# EAGLE design oresat-backplane-1u (EAGLE 9.6.1)

## Sheet 1 of 9: Slot 1
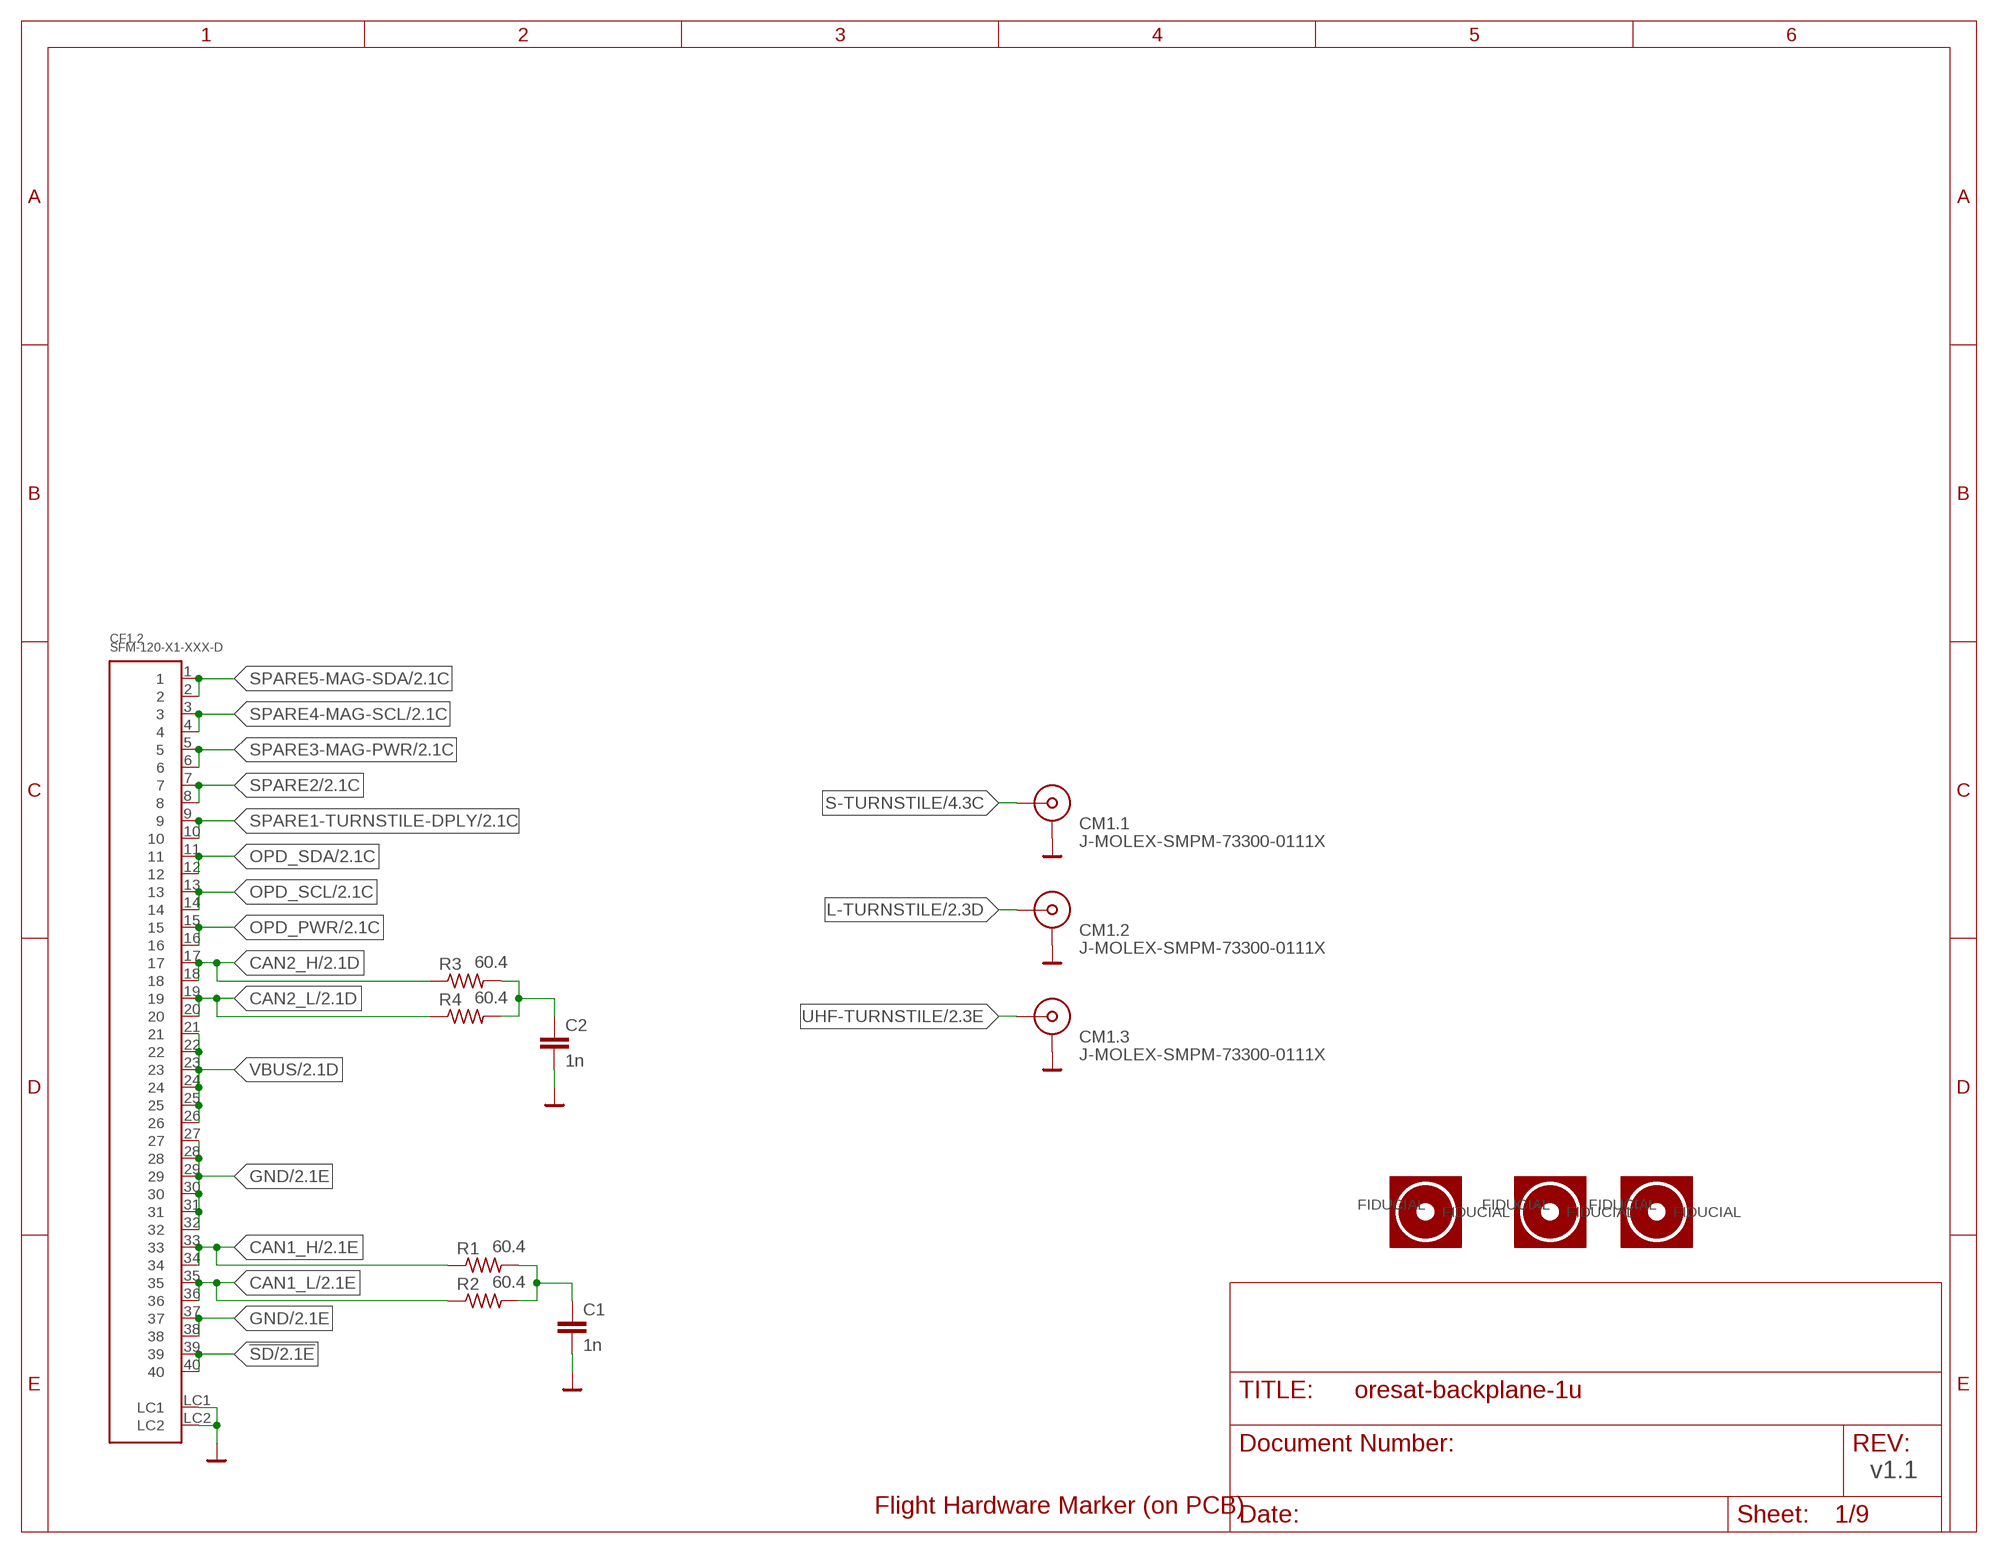
[diagram p0: schematic, sheet 1]

### Parts
C1  1n  C-EU0603-C-NOSILK  [.0603-C-NOSILK]
C2  1n  C-EU0603-C-NOSILK  [.0603-C-NOSILK]
CF1.2  SFM-120-X1-XXX-D  [SFM-120-X1-XXX-D]
CM1.1  J-MOLEX-SMPM-73300-0111X  [J-MOLEX-SMPM-73300-0111X]
CM1.2  J-MOLEX-SMPM-73300-0111X  [J-MOLEX-SMPM-73300-0111X]
CM1.3  J-MOLEX-SMPM-73300-0111X  [J-MOLEX-SMPM-73300-0111X]
FIDUCIAL1  FIDUCIAL-1.0X2.0  [FIDUCIAL-1.0X2.0]
FIDUCIAL2  FIDUCIAL-1.0X2.0  [FIDUCIAL-1.0X2.0]
FIDUCIAL3  FIDUCIAL-1.0X2.0  [FIDUCIAL-1.0X2.0]
R1  60.4  R-US_1206-C  [1206-C]
R2  60.4  R-US_1206-C  [1206-C]
R3  60.4  R-US_1206-C  [1206-C]
R4  60.4  R-US_1206-C  [1206-C]
U$1  FLIGHMARKERNEW  [FLIGHTMARKER_NEW_BOARDS]

### Nets
!SD [SHUTDOWN]: CF1.2.39 CF1.2.40 ; also sheet 2,3,4,5,6,7,8
CAN1_H: CF1.2.33 CF1.2.34 R1.1 ; also sheet 2,3,4,5,6,7,8
CAN1_L: CF1.2.35 CF1.2.36 R2.1 ; also sheet 2,3,4,5,6,7,8
CAN2_H: CF1.2.17 CF1.2.18 R3.1 ; also sheet 2,3,4,5,6,7,8
CAN2_L: CF1.2.19 CF1.2.20 R4.1 ; also sheet 2,3,4,5,6,7,8
GND: C1.2 C2.2 CF1.2.27 CF1.2.28 CF1.2.29 CF1.2.30 CF1.2.31 CF1.2.32 CF1.2.37 CF1.2.38 CF1.2.LC1 CF1.2.LC2 CM1.1.P$1(SHIELD1) CM1.1.P$2(SHIELD1) CM1.1.P$3(SHIELD1) CM1.1.P$4(SHIELD1) CM1.2.P$1(SHIELD1) CM1.2.P$2(SHIELD1) CM1.2.P$3(SHIELD1) CM1.2.P$4(SHIELD1) CM1.3.P$1(SHIELD1) CM1.3.P$2(SHIELD1) CM1.3.P$3(SHIELD1) CM1.3.P$4(SHIELD1) ; also sheet 2,3,4,5,6,7,8,9
L-TURNSTILE [RF]: CM1.2.RF-DOWN(RF) ; also sheet 2
N$1: C2.1 R3.2 R4.2
N$2: C1.1 R1.2 R2.2
OPD_PWR: CF1.2.15 CF1.2.16 ; also sheet 2,3,4,5,6,7,8
OPD_SCL: CF1.2.13 CF1.2.14 ; also sheet 2,3,4,5,6,7,8
OPD_SDA: CF1.2.11 CF1.2.12 ; also sheet 2,3,4,5,6,7,8
S-TURNSTILE [RF]: CM1.1.RF-DOWN(RF) ; also sheet 4
SPARE1-TURNSTILE-DPLY: CF1.2.9 CF1.2.10 ; also sheet 2,3,4,5,6,7,8
SPARE2: CF1.2.7 CF1.2.8 ; also sheet 2,3,4,5,6,7,8,9
SPARE3-MAG-PWR: CF1.2.5 CF1.2.6 ; also sheet 2,3,4,5,6,7,8,9
SPARE4-MAG-SCL: CF1.2.3 CF1.2.4 ; also sheet 2,3,4,5,6,7,8,9
SPARE5-MAG-SDA: CF1.2.1 CF1.2.2 ; also sheet 2,3,4,5,6,7,8,9
UHF-TURNSTILE [RF]: CM1.3.RF-DOWN(RF) ; also sheet 2
VBUS: CF1.2.21 CF1.2.22 CF1.2.23 CF1.2.24 CF1.2.25 CF1.2.26 ; also sheet 2,3,4,5,6,7,8
Unconnected: FIDUCIAL1.FIDUCIAL FIDUCIAL2.FIDUCIAL FIDUCIAL3.FIDUCIAL

### Notes on the sheet
- v1.1

## Sheet 2 of 9: Slot 2
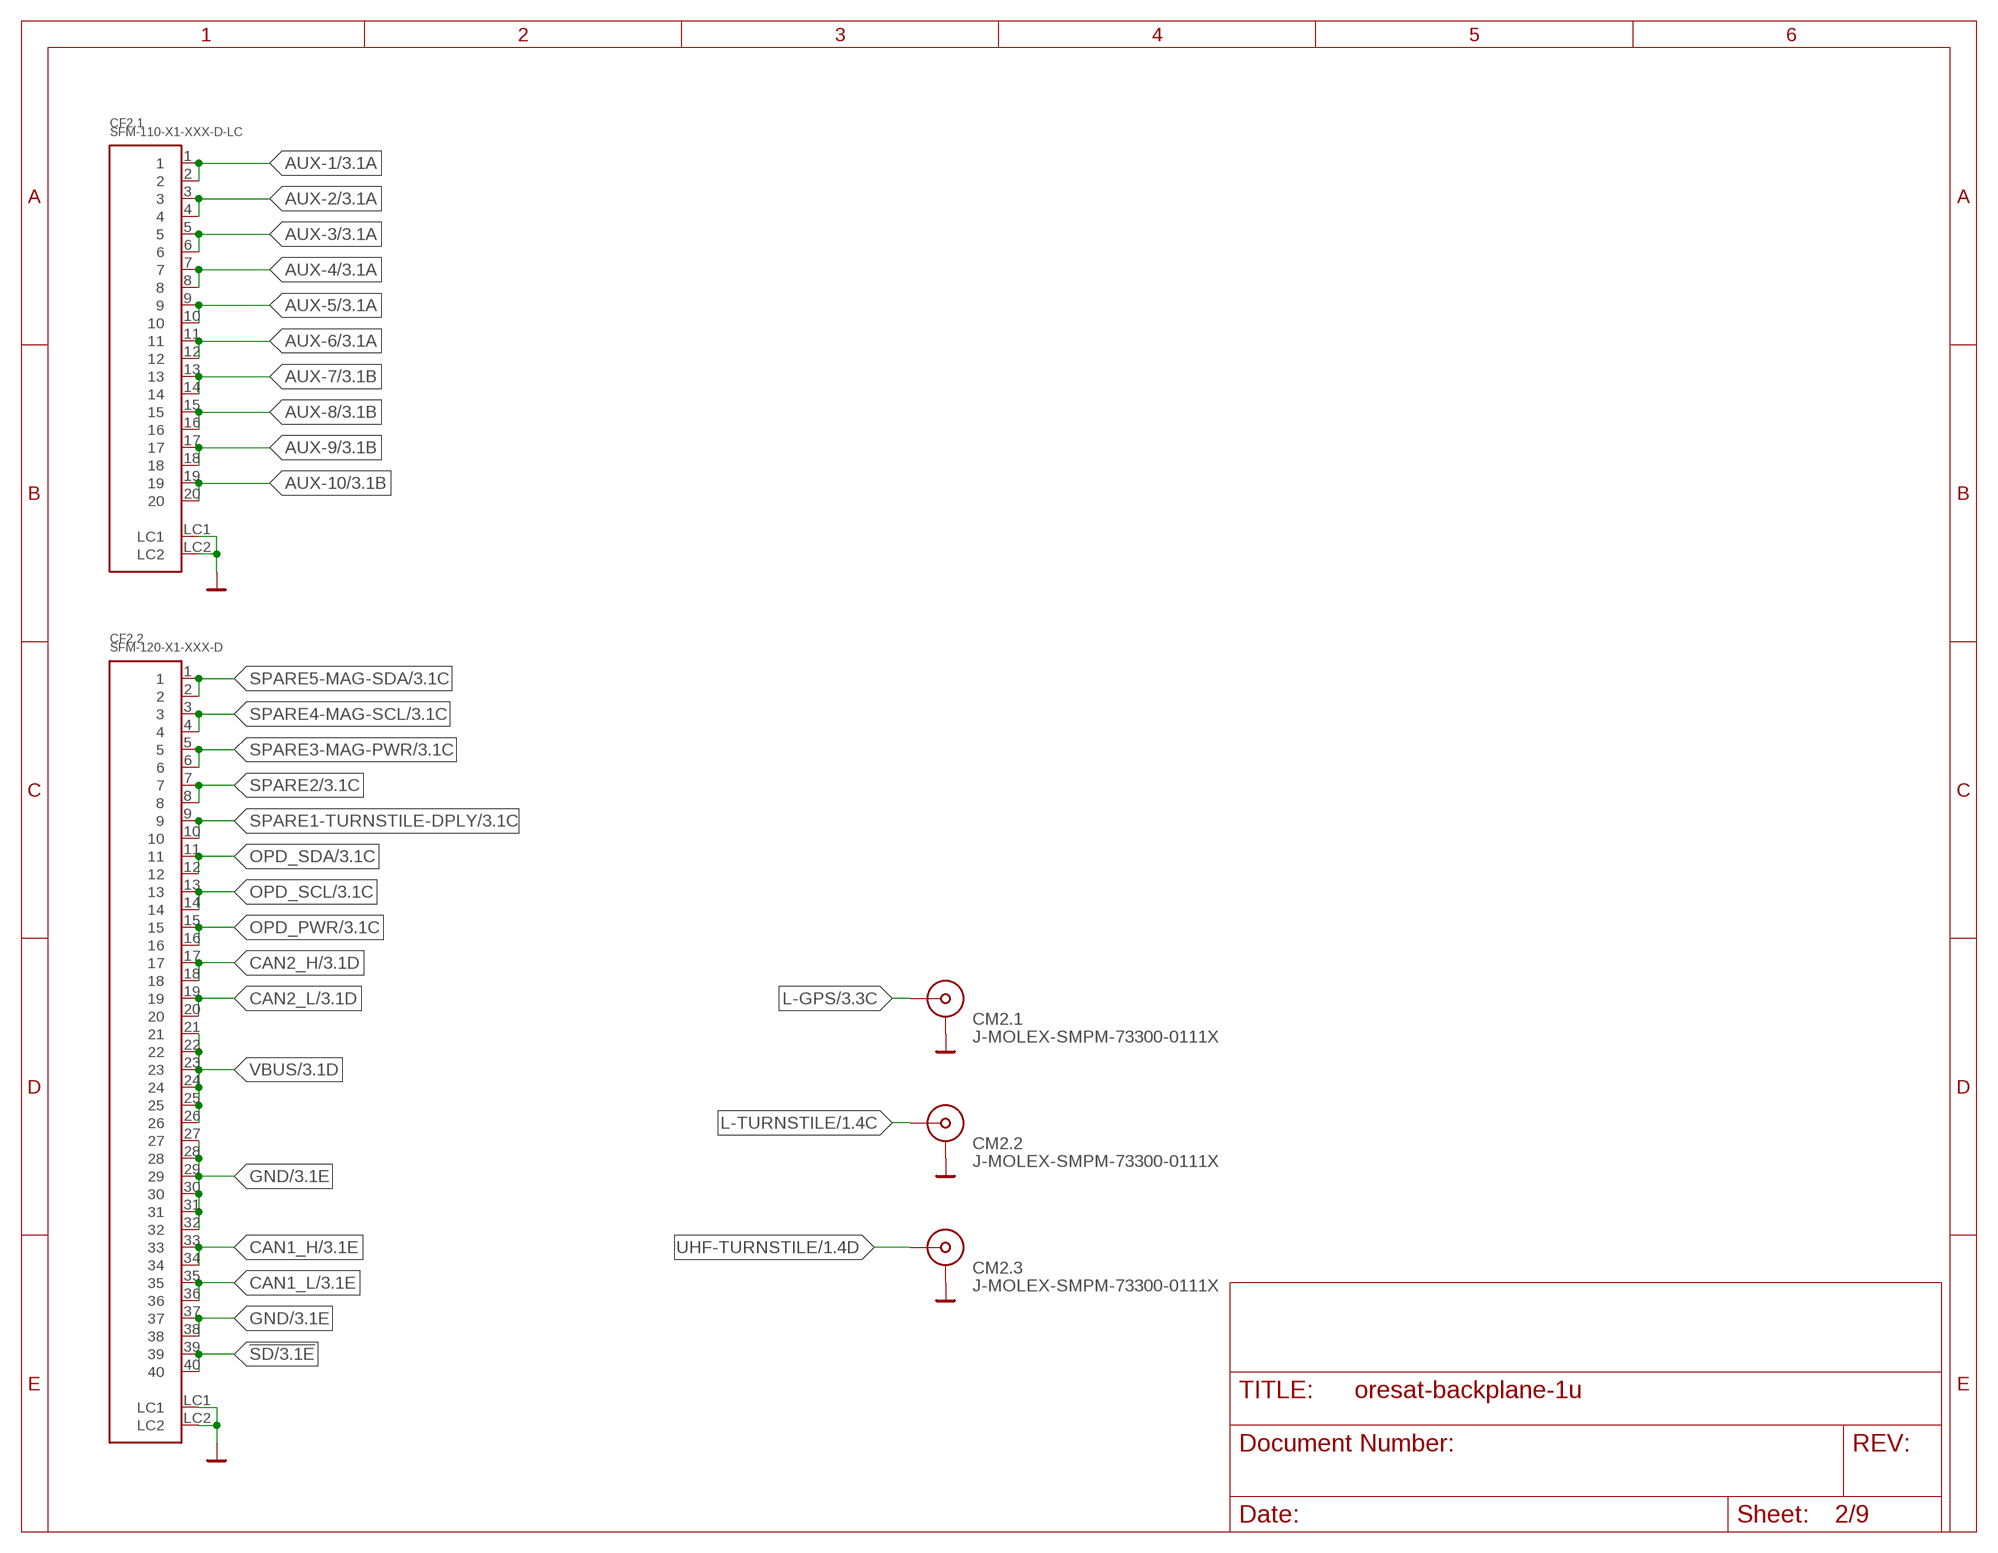
[diagram p1: schematic, sheet 2]

### Parts
CF2.1  SFM-110-X1-XXX-D-LC  [SFM-110-X1-XXX-D-LC]
CF2.2  SFM-120-X1-XXX-D  [SFM-120-X1-XXX-D]
CM2.1  J-MOLEX-SMPM-73300-0111X  [J-MOLEX-SMPM-73300-0111X]
CM2.2  J-MOLEX-SMPM-73300-0111X  [J-MOLEX-SMPM-73300-0111X]
CM2.3  J-MOLEX-SMPM-73300-0111X  [J-MOLEX-SMPM-73300-0111X]

### Nets
!SD [SHUTDOWN]: CF2.2.39 CF2.2.40 ; also sheet 1,3,4,5,6,7,8
AUX-1: CF2.1.1 CF2.1.2 ; also sheet 3,4,7,8
AUX-2: CF2.1.3 CF2.1.4 ; also sheet 3,4,7,8
AUX-3: CF2.1.5 CF2.1.6 ; also sheet 3,4,7,8
AUX-4: CF2.1.7 CF2.1.8 ; also sheet 3,4,7,8
AUX-5: CF2.1.9 CF2.1.10 ; also sheet 3,4,7,8
AUX-6: CF2.1.11 CF2.1.12 ; also sheet 3,4,7,8
AUX-7: CF2.1.13 CF2.1.14 ; also sheet 3,4,7,8
AUX-8: CF2.1.15 CF2.1.16 ; also sheet 3,4,7,8
AUX-9: CF2.1.17 CF2.1.18 ; also sheet 3,4,7,8
AUX-10: CF2.1.19 CF2.1.20 ; also sheet 3,4,7,8
CAN1_H: CF2.2.33 CF2.2.34 ; also sheet 1,3,4,5,6,7,8
CAN1_L: CF2.2.35 CF2.2.36 ; also sheet 1,3,4,5,6,7,8
CAN2_H: CF2.2.17 CF2.2.18 ; also sheet 1,3,4,5,6,7,8
CAN2_L: CF2.2.19 CF2.2.20 ; also sheet 1,3,4,5,6,7,8
GND: CF2.1.LC1 CF2.1.LC2 CF2.2.27 CF2.2.28 CF2.2.29 CF2.2.30 CF2.2.31 CF2.2.32 CF2.2.37 CF2.2.38 CF2.2.LC1 CF2.2.LC2 CM2.1.P$1(SHIELD1) CM2.1.P$2(SHIELD1) CM2.1.P$3(SHIELD1) CM2.1.P$4(SHIELD1) CM2.2.P$1(SHIELD1) CM2.2.P$2(SHIELD1) CM2.2.P$3(SHIELD1) CM2.2.P$4(SHIELD1) CM2.3.P$1(SHIELD1) CM2.3.P$2(SHIELD1) CM2.3.P$3(SHIELD1) CM2.3.P$4(SHIELD1) ; also sheet 1,3,4,5,6,7,8,9
L-GPS [RF]: CM2.1.RF-DOWN(RF) ; also sheet 3
L-TURNSTILE [RF]: CM2.2.RF-DOWN(RF) ; also sheet 1
OPD_PWR: CF2.2.15 CF2.2.16 ; also sheet 1,3,4,5,6,7,8
OPD_SCL: CF2.2.13 CF2.2.14 ; also sheet 1,3,4,5,6,7,8
OPD_SDA: CF2.2.11 CF2.2.12 ; also sheet 1,3,4,5,6,7,8
SPARE1-TURNSTILE-DPLY: CF2.2.9 CF2.2.10 ; also sheet 1,3,4,5,6,7,8
SPARE2: CF2.2.7 CF2.2.8 ; also sheet 1,3,4,5,6,7,8,9
SPARE3-MAG-PWR: CF2.2.5 CF2.2.6 ; also sheet 1,3,4,5,6,7,8,9
SPARE4-MAG-SCL: CF2.2.3 CF2.2.4 ; also sheet 1,3,4,5,6,7,8,9
SPARE5-MAG-SDA: CF2.2.1 CF2.2.2 ; also sheet 1,3,4,5,6,7,8,9
UHF-TURNSTILE [RF]: CM2.3.RF-DOWN(RF) ; also sheet 1
VBUS: CF2.2.21 CF2.2.22 CF2.2.23 CF2.2.24 CF2.2.25 CF2.2.26 ; also sheet 1,3,4,5,6,7,8

## Sheet 3 of 9: Slot 3
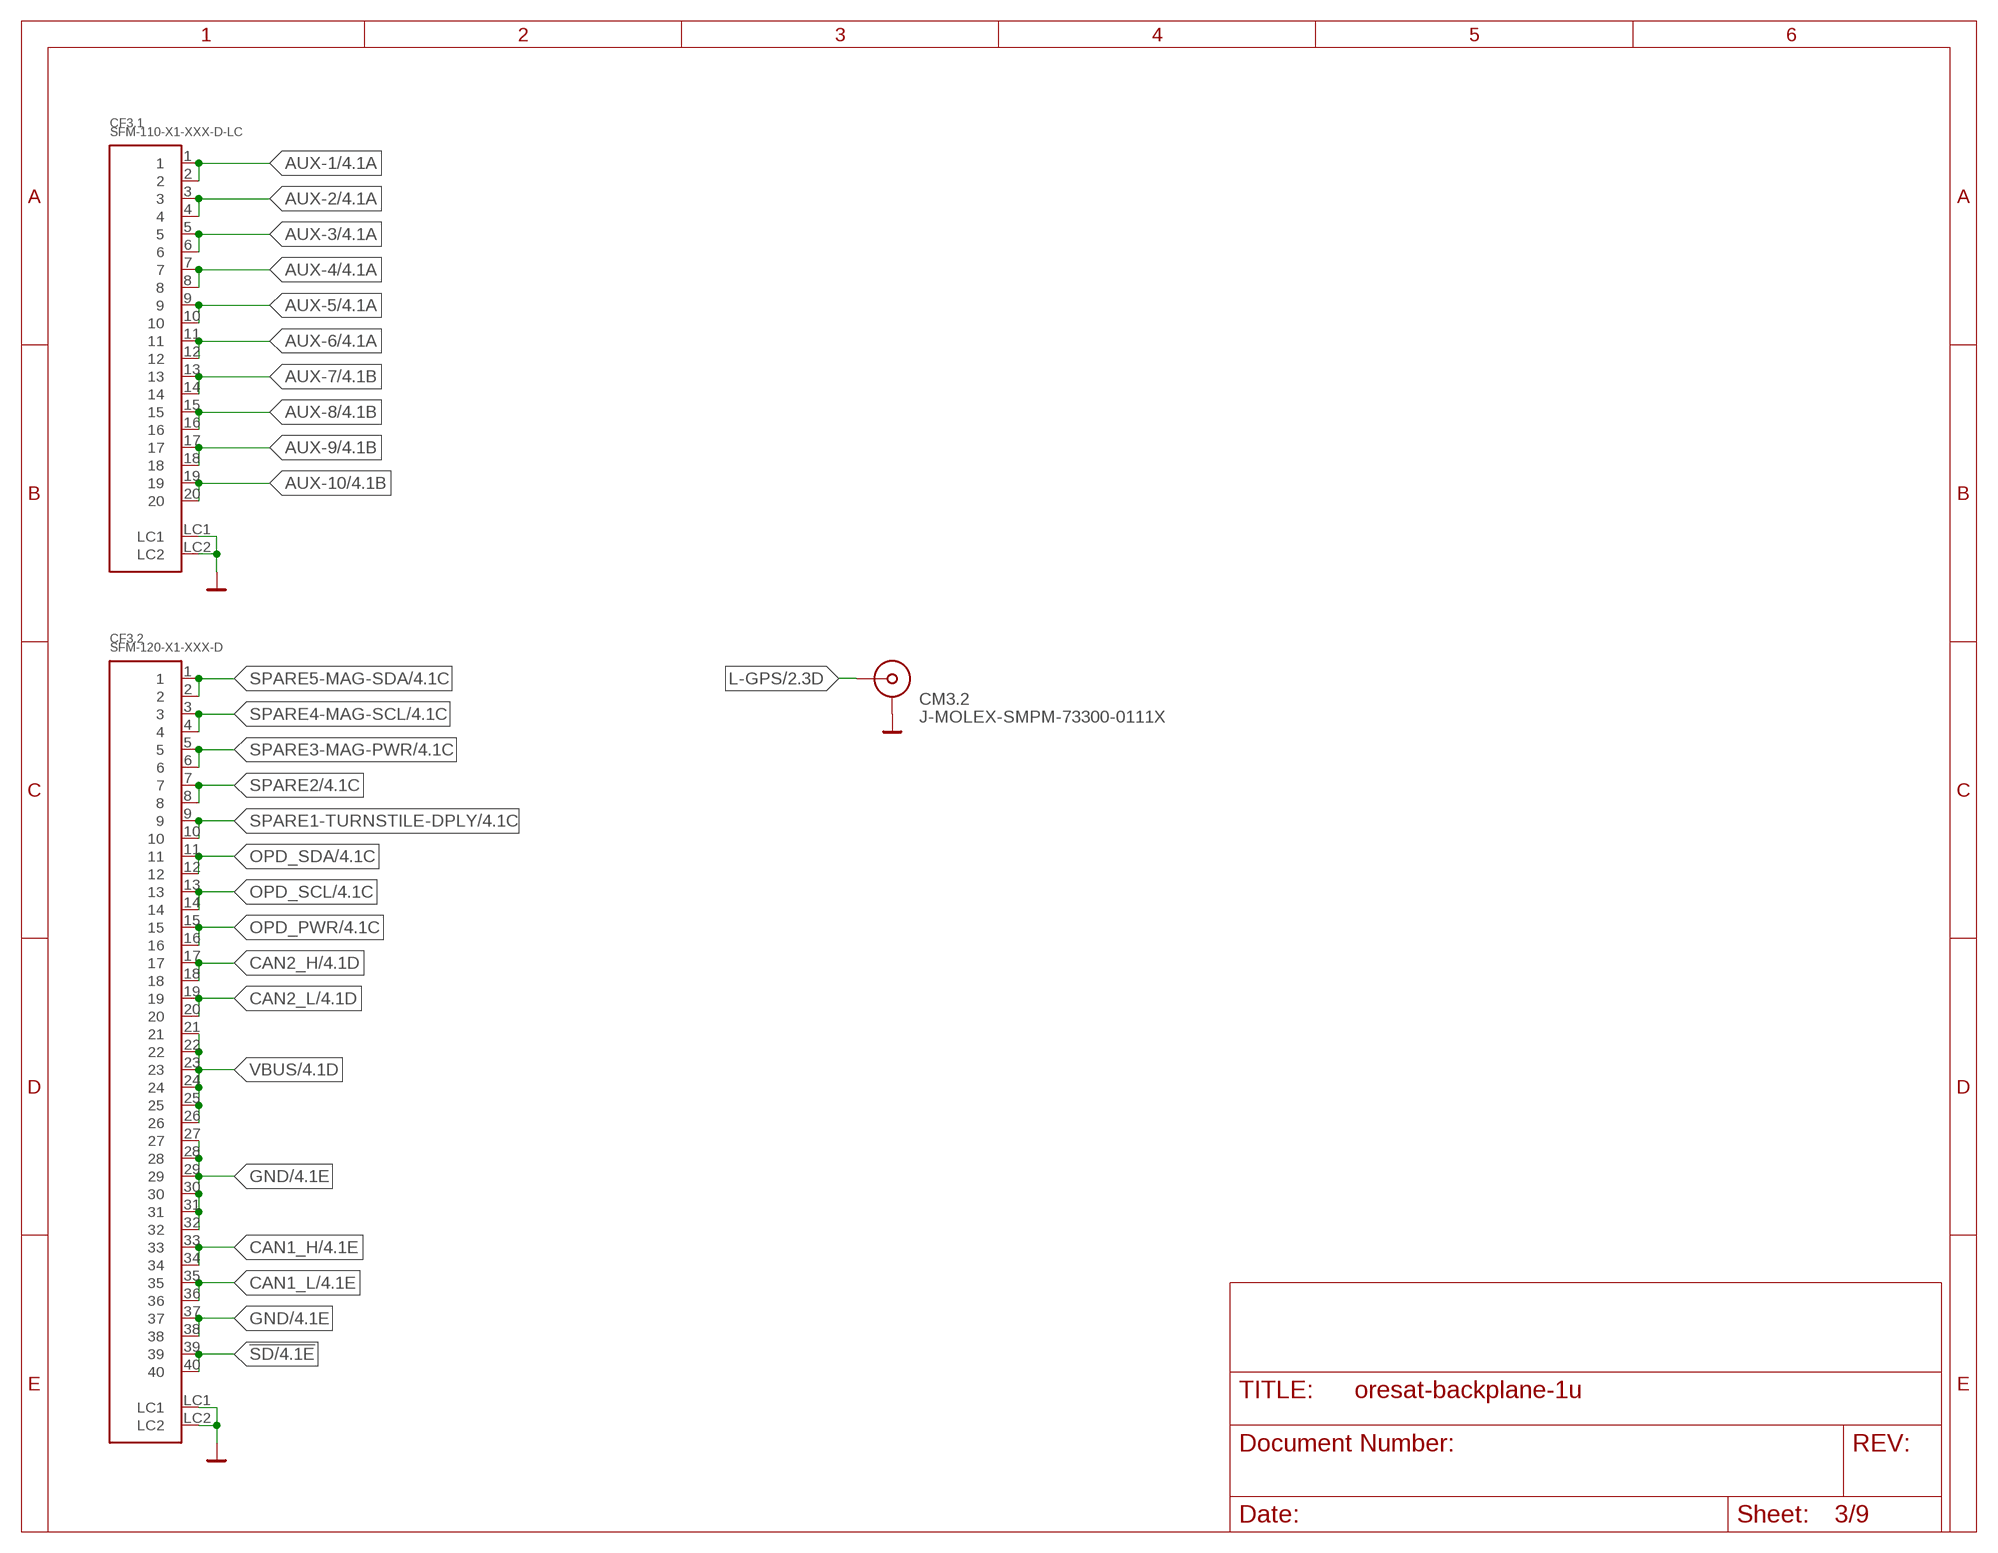
[diagram p2: schematic, sheet 3]

### Parts
CF3.1  SFM-110-X1-XXX-D-LC  [SFM-110-X1-XXX-D-LC]
CF3.2  SFM-120-X1-XXX-D  [SFM-120-X1-XXX-D]
CM3.2  J-MOLEX-SMPM-73300-0111X  [J-MOLEX-SMPM-73300-0111X]

### Nets
!SD [SHUTDOWN]: CF3.2.39 CF3.2.40 ; also sheet 1,2,4,5,6,7,8
AUX-1: CF3.1.1 CF3.1.2 ; also sheet 2,4,7,8
AUX-2: CF3.1.3 CF3.1.4 ; also sheet 2,4,7,8
AUX-3: CF3.1.5 CF3.1.6 ; also sheet 2,4,7,8
AUX-4: CF3.1.7 CF3.1.8 ; also sheet 2,4,7,8
AUX-5: CF3.1.9 CF3.1.10 ; also sheet 2,4,7,8
AUX-6: CF3.1.11 CF3.1.12 ; also sheet 2,4,7,8
AUX-7: CF3.1.13 CF3.1.14 ; also sheet 2,4,7,8
AUX-8: CF3.1.15 CF3.1.16 ; also sheet 2,4,7,8
AUX-9: CF3.1.17 CF3.1.18 ; also sheet 2,4,7,8
AUX-10: CF3.1.19 CF3.1.20 ; also sheet 2,4,7,8
CAN1_H: CF3.2.33 CF3.2.34 ; also sheet 1,2,4,5,6,7,8
CAN1_L: CF3.2.35 CF3.2.36 ; also sheet 1,2,4,5,6,7,8
CAN2_H: CF3.2.17 CF3.2.18 ; also sheet 1,2,4,5,6,7,8
CAN2_L: CF3.2.19 CF3.2.20 ; also sheet 1,2,4,5,6,7,8
GND: CF3.1.LC1 CF3.1.LC2 CF3.2.27 CF3.2.28 CF3.2.29 CF3.2.30 CF3.2.31 CF3.2.32 CF3.2.37 CF3.2.38 CF3.2.LC1 CF3.2.LC2 CM3.2.P$1(SHIELD1) CM3.2.P$2(SHIELD1) CM3.2.P$3(SHIELD1) CM3.2.P$4(SHIELD1) ; also sheet 1,2,4,5,6,7,8,9
L-GPS [RF]: CM3.2.RF-DOWN(RF) ; also sheet 2
OPD_PWR: CF3.2.15 CF3.2.16 ; also sheet 1,2,4,5,6,7,8
OPD_SCL: CF3.2.13 CF3.2.14 ; also sheet 1,2,4,5,6,7,8
OPD_SDA: CF3.2.11 CF3.2.12 ; also sheet 1,2,4,5,6,7,8
SPARE1-TURNSTILE-DPLY: CF3.2.9 CF3.2.10 ; also sheet 1,2,4,5,6,7,8
SPARE2: CF3.2.7 CF3.2.8 ; also sheet 1,2,4,5,6,7,8,9
SPARE3-MAG-PWR: CF3.2.5 CF3.2.6 ; also sheet 1,2,4,5,6,7,8,9
SPARE4-MAG-SCL: CF3.2.3 CF3.2.4 ; also sheet 1,2,4,5,6,7,8,9
SPARE5-MAG-SDA: CF3.2.1 CF3.2.2 ; also sheet 1,2,4,5,6,7,8,9
VBUS: CF3.2.21 CF3.2.22 CF3.2.23 CF3.2.24 CF3.2.25 CF3.2.26 ; also sheet 1,2,4,5,6,7,8

## Sheet 4 of 9: Slot 4
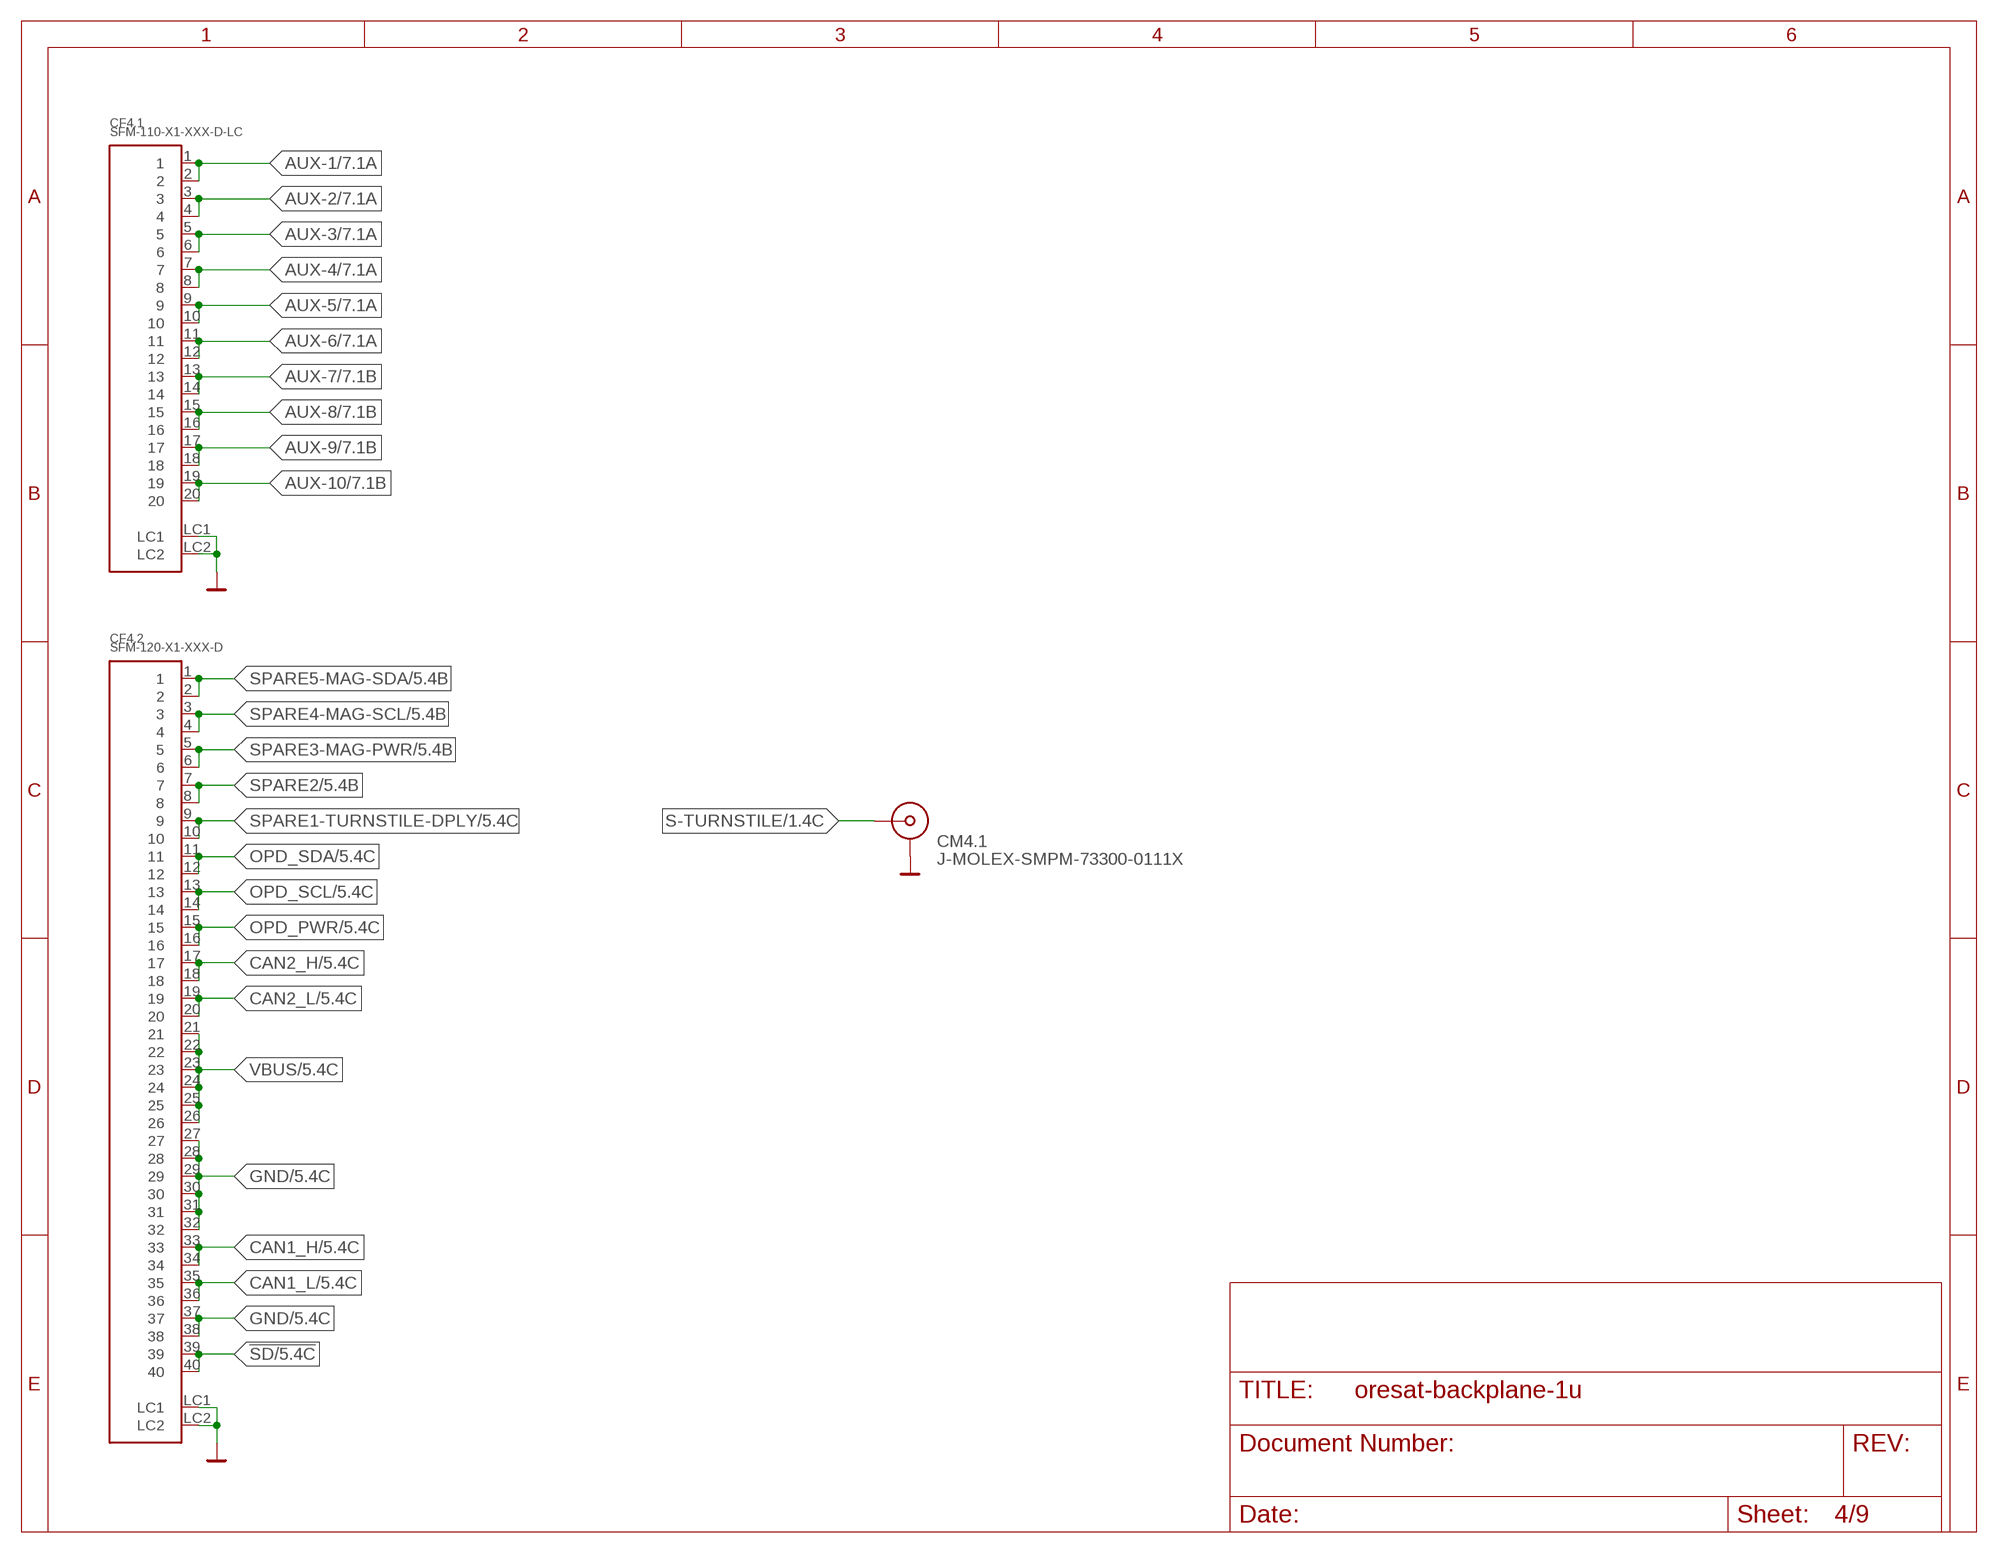
[diagram p3: schematic, sheet 4]

### Parts
CF4.1  SFM-110-X1-XXX-D-LC  [SFM-110-X1-XXX-D-LC]
CF4.2  SFM-120-X1-XXX-D  [SFM-120-X1-XXX-D]
CM4.1  J-MOLEX-SMPM-73300-0111X  [J-MOLEX-SMPM-73300-0111X]

### Nets
!SD [SHUTDOWN]: CF4.2.39 CF4.2.40 ; also sheet 1,2,3,5,6,7,8
AUX-1: CF4.1.1 CF4.1.2 ; also sheet 2,3,7,8
AUX-2: CF4.1.3 CF4.1.4 ; also sheet 2,3,7,8
AUX-3: CF4.1.5 CF4.1.6 ; also sheet 2,3,7,8
AUX-4: CF4.1.7 CF4.1.8 ; also sheet 2,3,7,8
AUX-5: CF4.1.9 CF4.1.10 ; also sheet 2,3,7,8
AUX-6: CF4.1.11 CF4.1.12 ; also sheet 2,3,7,8
AUX-7: CF4.1.13 CF4.1.14 ; also sheet 2,3,7,8
AUX-8: CF4.1.15 CF4.1.16 ; also sheet 2,3,7,8
AUX-9: CF4.1.17 CF4.1.18 ; also sheet 2,3,7,8
AUX-10: CF4.1.19 CF4.1.20 ; also sheet 2,3,7,8
CAN1_H: CF4.2.33 CF4.2.34 ; also sheet 1,2,3,5,6,7,8
CAN1_L: CF4.2.35 CF4.2.36 ; also sheet 1,2,3,5,6,7,8
CAN2_H: CF4.2.17 CF4.2.18 ; also sheet 1,2,3,5,6,7,8
CAN2_L: CF4.2.19 CF4.2.20 ; also sheet 1,2,3,5,6,7,8
GND: CF4.1.LC1 CF4.1.LC2 CF4.2.27 CF4.2.28 CF4.2.29 CF4.2.30 CF4.2.31 CF4.2.32 CF4.2.37 CF4.2.38 CF4.2.LC1 CF4.2.LC2 CM4.1.P$1(SHIELD1) CM4.1.P$2(SHIELD1) CM4.1.P$3(SHIELD1) CM4.1.P$4(SHIELD1) ; also sheet 1,2,3,5,6,7,8,9
OPD_PWR: CF4.2.15 CF4.2.16 ; also sheet 1,2,3,5,6,7,8
OPD_SCL: CF4.2.13 CF4.2.14 ; also sheet 1,2,3,5,6,7,8
OPD_SDA: CF4.2.11 CF4.2.12 ; also sheet 1,2,3,5,6,7,8
S-TURNSTILE [RF]: CM4.1.RF-DOWN(RF) ; also sheet 1
SPARE1-TURNSTILE-DPLY: CF4.2.9 CF4.2.10 ; also sheet 1,2,3,5,6,7,8
SPARE2: CF4.2.7 CF4.2.8 ; also sheet 1,2,3,5,6,7,8,9
SPARE3-MAG-PWR: CF4.2.5 CF4.2.6 ; also sheet 1,2,3,5,6,7,8,9
SPARE4-MAG-SCL: CF4.2.3 CF4.2.4 ; also sheet 1,2,3,5,6,7,8,9
SPARE5-MAG-SDA: CF4.2.1 CF4.2.2 ; also sheet 1,2,3,5,6,7,8,9
VBUS: CF4.2.21 CF4.2.22 CF4.2.23 CF4.2.24 CF4.2.25 CF4.2.26 ; also sheet 1,2,3,5,6,7,8

## Sheet 5 of 9: Slot 5
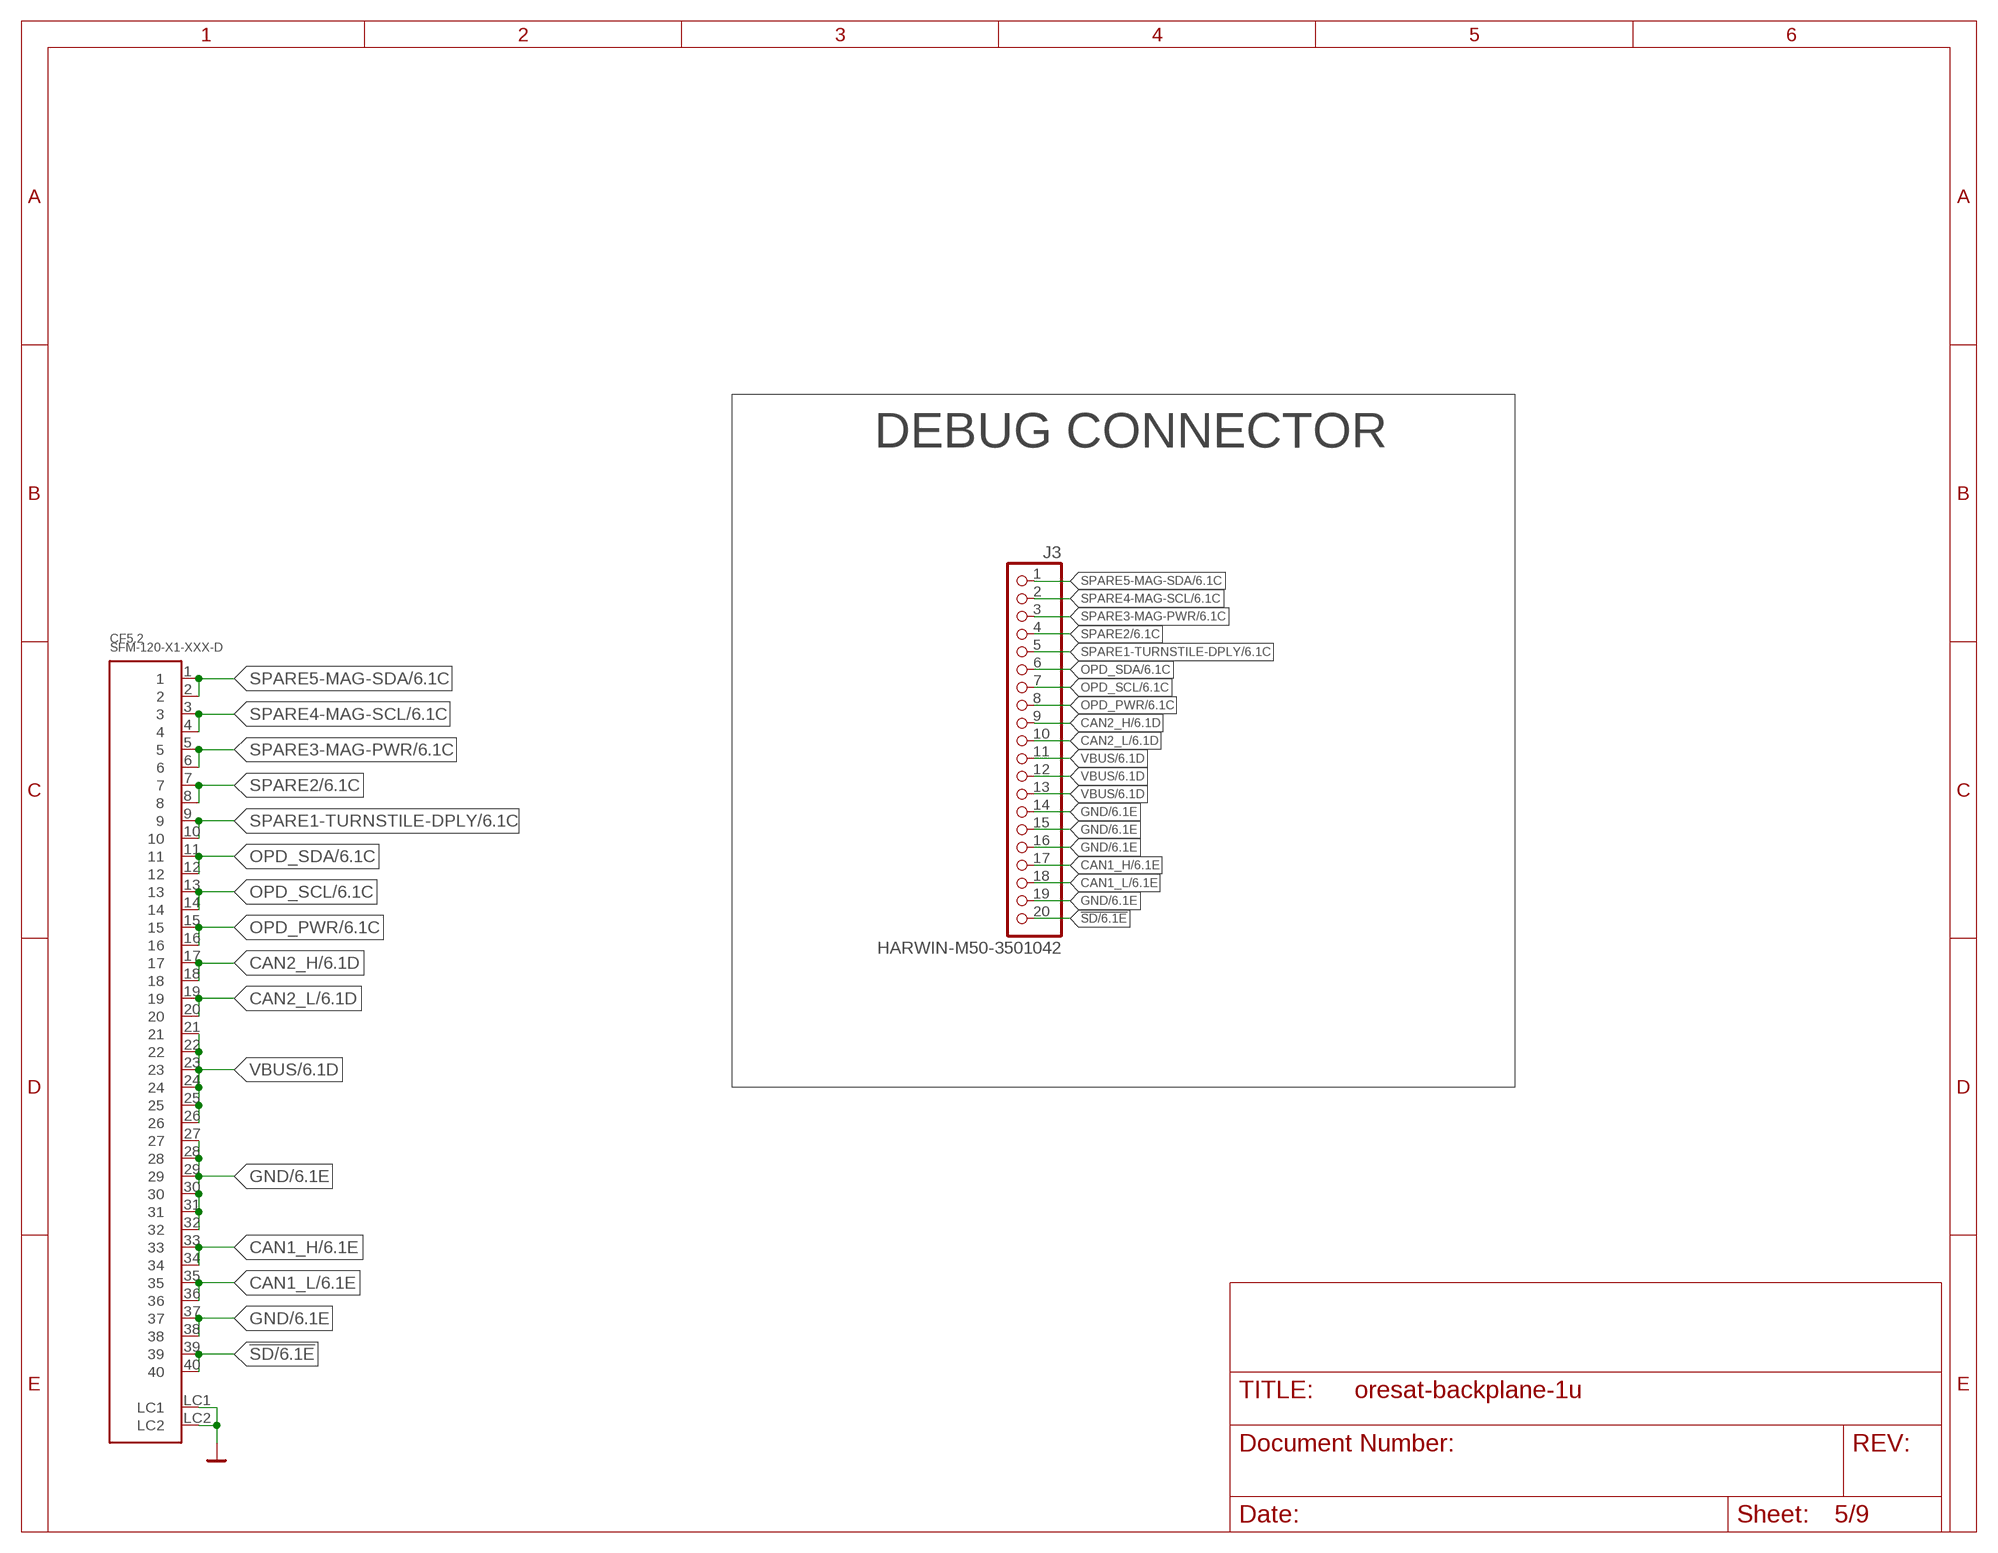
[diagram p4: schematic, sheet 5]

### Parts
CF5.2  SFM-120-X1-XXX-D  [SFM-120-X1-XXX-D]
J3  HARWIN-M50-3501042  [HARWIN-M50-3501042]

### Nets
!SD [SHUTDOWN]: CF5.2.39 CF5.2.40 J3.20 ; also sheet 1,2,3,4,6,7,8
CAN1_H: CF5.2.33 CF5.2.34 J3.17 ; also sheet 1,2,3,4,6,7,8
CAN1_L: CF5.2.35 CF5.2.36 J3.18 ; also sheet 1,2,3,4,6,7,8
CAN2_H: CF5.2.17 CF5.2.18 J3.9 ; also sheet 1,2,3,4,6,7,8
CAN2_L: CF5.2.19 CF5.2.20 J3.10 ; also sheet 1,2,3,4,6,7,8
GND: CF5.2.27 CF5.2.28 CF5.2.29 CF5.2.30 CF5.2.31 CF5.2.32 CF5.2.37 CF5.2.38 CF5.2.LC1 CF5.2.LC2 J3.14 J3.15 J3.16 J3.19 ; also sheet 1,2,3,4,6,7,8,9
OPD_PWR: CF5.2.15 CF5.2.16 J3.8 ; also sheet 1,2,3,4,6,7,8
OPD_SCL: CF5.2.13 CF5.2.14 J3.7 ; also sheet 1,2,3,4,6,7,8
OPD_SDA: CF5.2.11 CF5.2.12 J3.6 ; also sheet 1,2,3,4,6,7,8
SPARE1-TURNSTILE-DPLY: CF5.2.9 CF5.2.10 J3.5 ; also sheet 1,2,3,4,6,7,8
SPARE2: CF5.2.7 CF5.2.8 J3.4 ; also sheet 1,2,3,4,6,7,8,9
SPARE3-MAG-PWR: CF5.2.5 CF5.2.6 J3.3 ; also sheet 1,2,3,4,6,7,8,9
SPARE4-MAG-SCL: CF5.2.3 CF5.2.4 J3.2 ; also sheet 1,2,3,4,6,7,8,9
SPARE5-MAG-SDA: CF5.2.1 CF5.2.2 J3.1 ; also sheet 1,2,3,4,6,7,8,9
VBUS: CF5.2.21 CF5.2.22 CF5.2.23 CF5.2.24 CF5.2.25 CF5.2.26 J3.11 J3.12 J3.13 ; also sheet 1,2,3,4,6,7,8

### Notes on the sheet
- DEBUG CONNECTOR

## Sheet 6 of 9: Slot 6
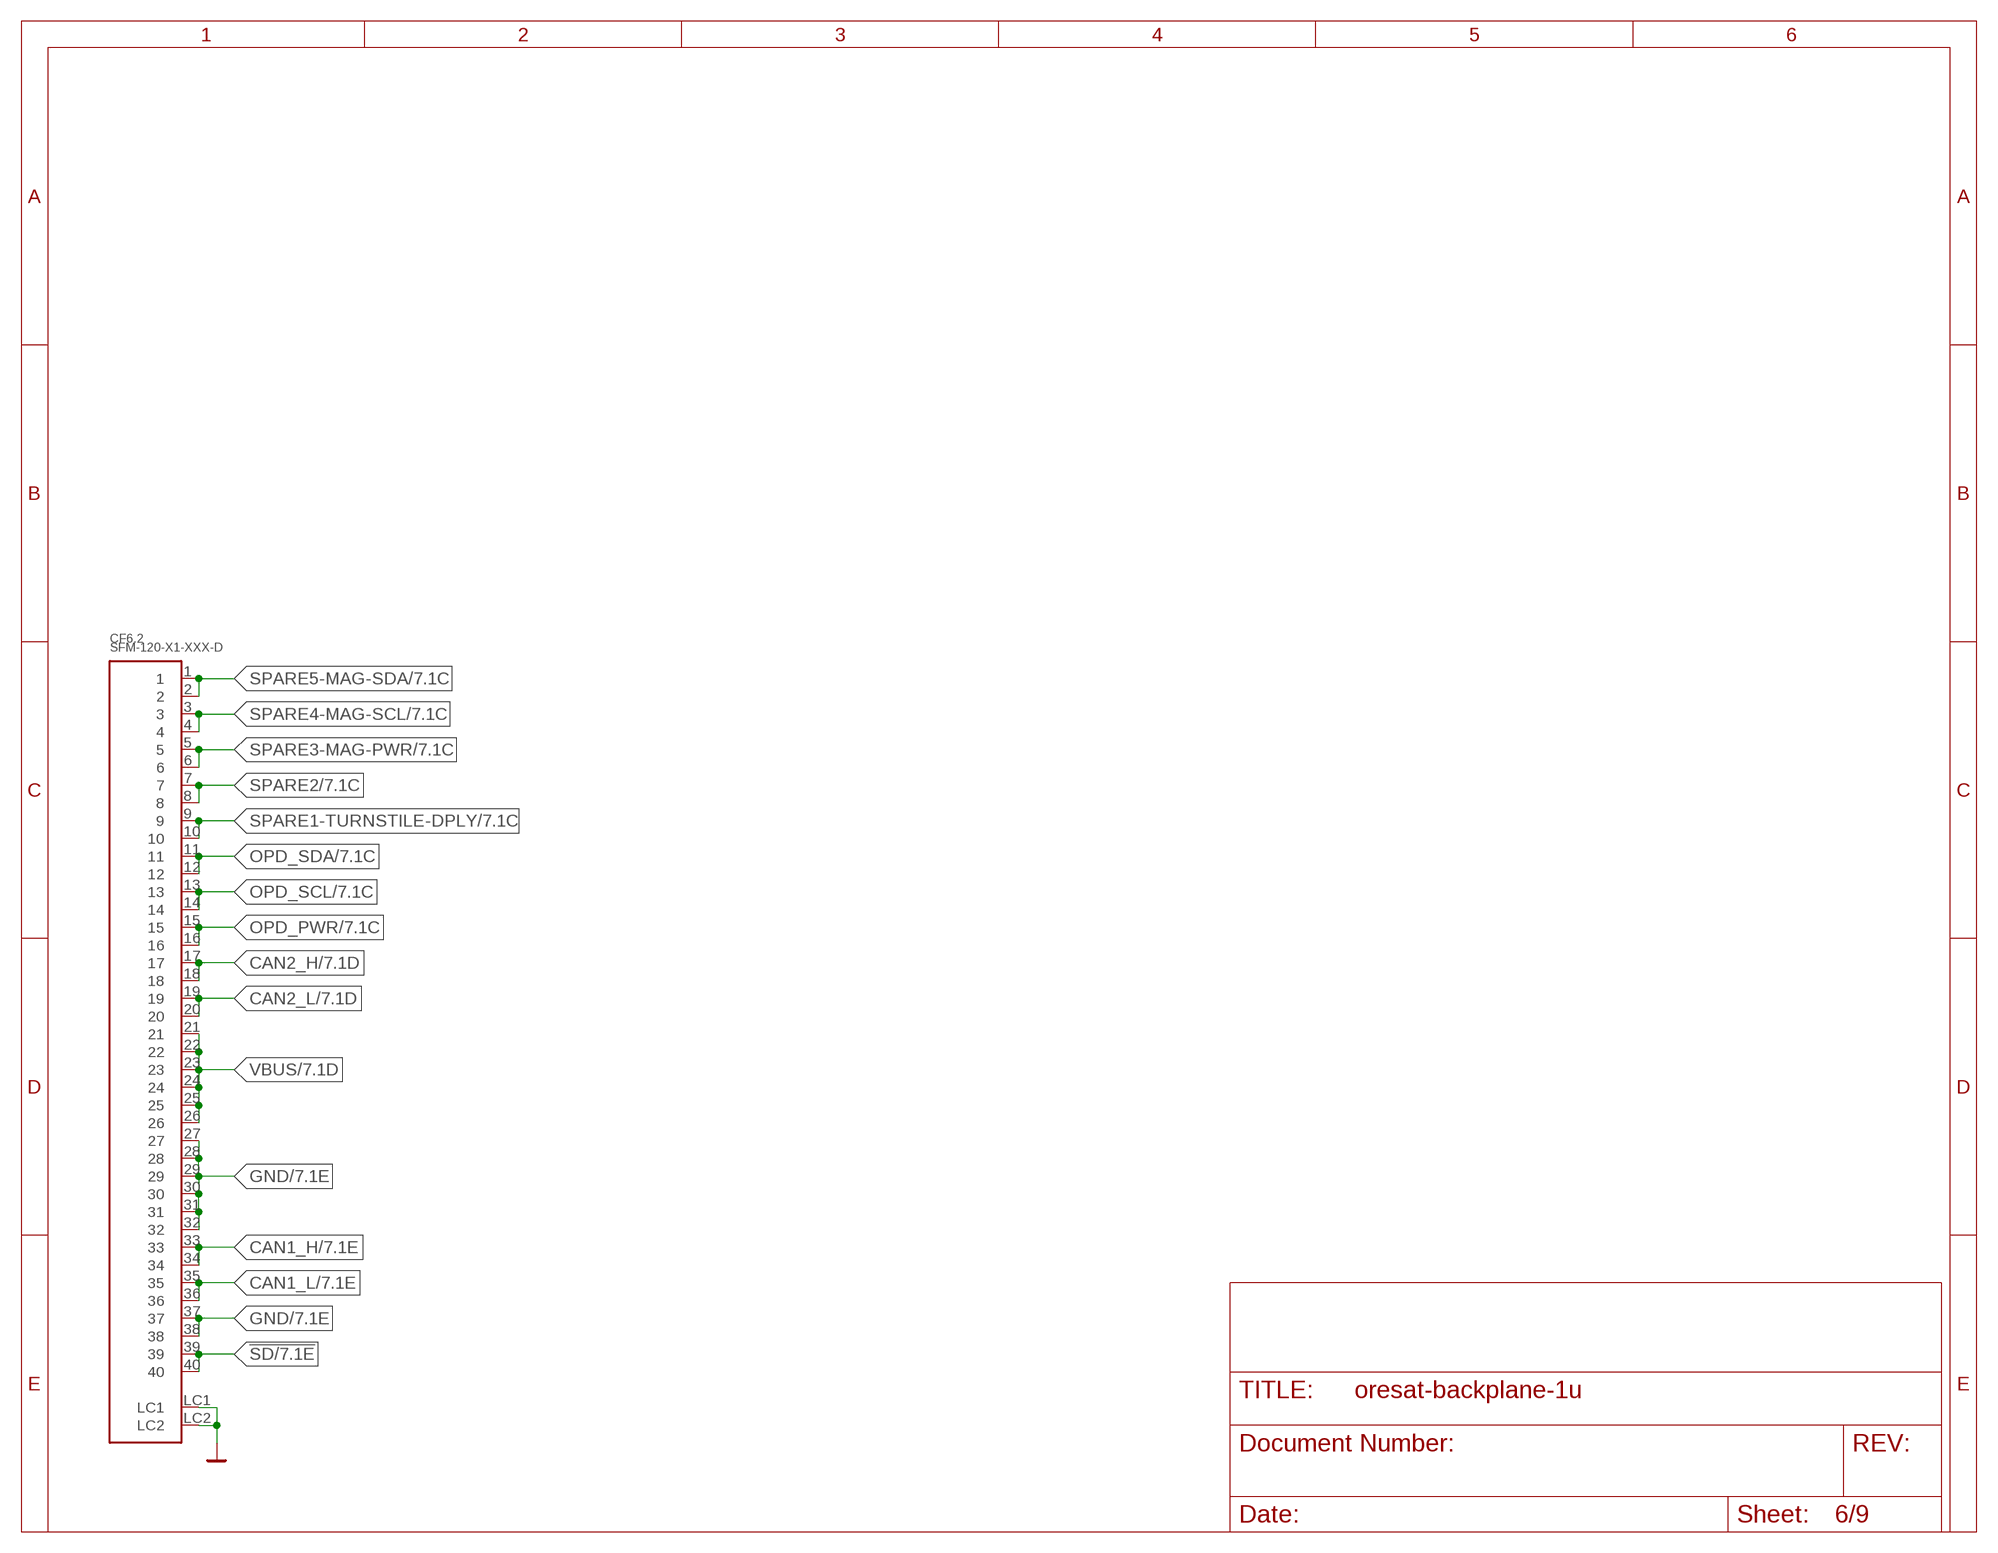
[diagram p5: schematic, sheet 6]

### Parts
CF6.2  SFM-120-X1-XXX-D  [SFM-120-X1-XXX-D]

### Nets
!SD [SHUTDOWN]: CF6.2.39 CF6.2.40 ; also sheet 1,2,3,4,5,7,8
CAN1_H: CF6.2.33 CF6.2.34 ; also sheet 1,2,3,4,5,7,8
CAN1_L: CF6.2.35 CF6.2.36 ; also sheet 1,2,3,4,5,7,8
CAN2_H: CF6.2.17 CF6.2.18 ; also sheet 1,2,3,4,5,7,8
CAN2_L: CF6.2.19 CF6.2.20 ; also sheet 1,2,3,4,5,7,8
GND: CF6.2.27 CF6.2.28 CF6.2.29 CF6.2.30 CF6.2.31 CF6.2.32 CF6.2.37 CF6.2.38 CF6.2.LC1 CF6.2.LC2 ; also sheet 1,2,3,4,5,7,8,9
OPD_PWR: CF6.2.15 CF6.2.16 ; also sheet 1,2,3,4,5,7,8
OPD_SCL: CF6.2.13 CF6.2.14 ; also sheet 1,2,3,4,5,7,8
OPD_SDA: CF6.2.11 CF6.2.12 ; also sheet 1,2,3,4,5,7,8
SPARE1-TURNSTILE-DPLY: CF6.2.9 CF6.2.10 ; also sheet 1,2,3,4,5,7,8
SPARE2: CF6.2.7 CF6.2.8 ; also sheet 1,2,3,4,5,7,8,9
SPARE3-MAG-PWR: CF6.2.5 CF6.2.6 ; also sheet 1,2,3,4,5,7,8,9
SPARE4-MAG-SCL: CF6.2.3 CF6.2.4 ; also sheet 1,2,3,4,5,7,8,9
SPARE5-MAG-SDA: CF6.2.1 CF6.2.2 ; also sheet 1,2,3,4,5,7,8,9
VBUS: CF6.2.21 CF6.2.22 CF6.2.23 CF6.2.24 CF6.2.25 CF6.2.26 ; also sheet 1,2,3,4,5,7,8

## Sheet 7 of 9: Slot 7
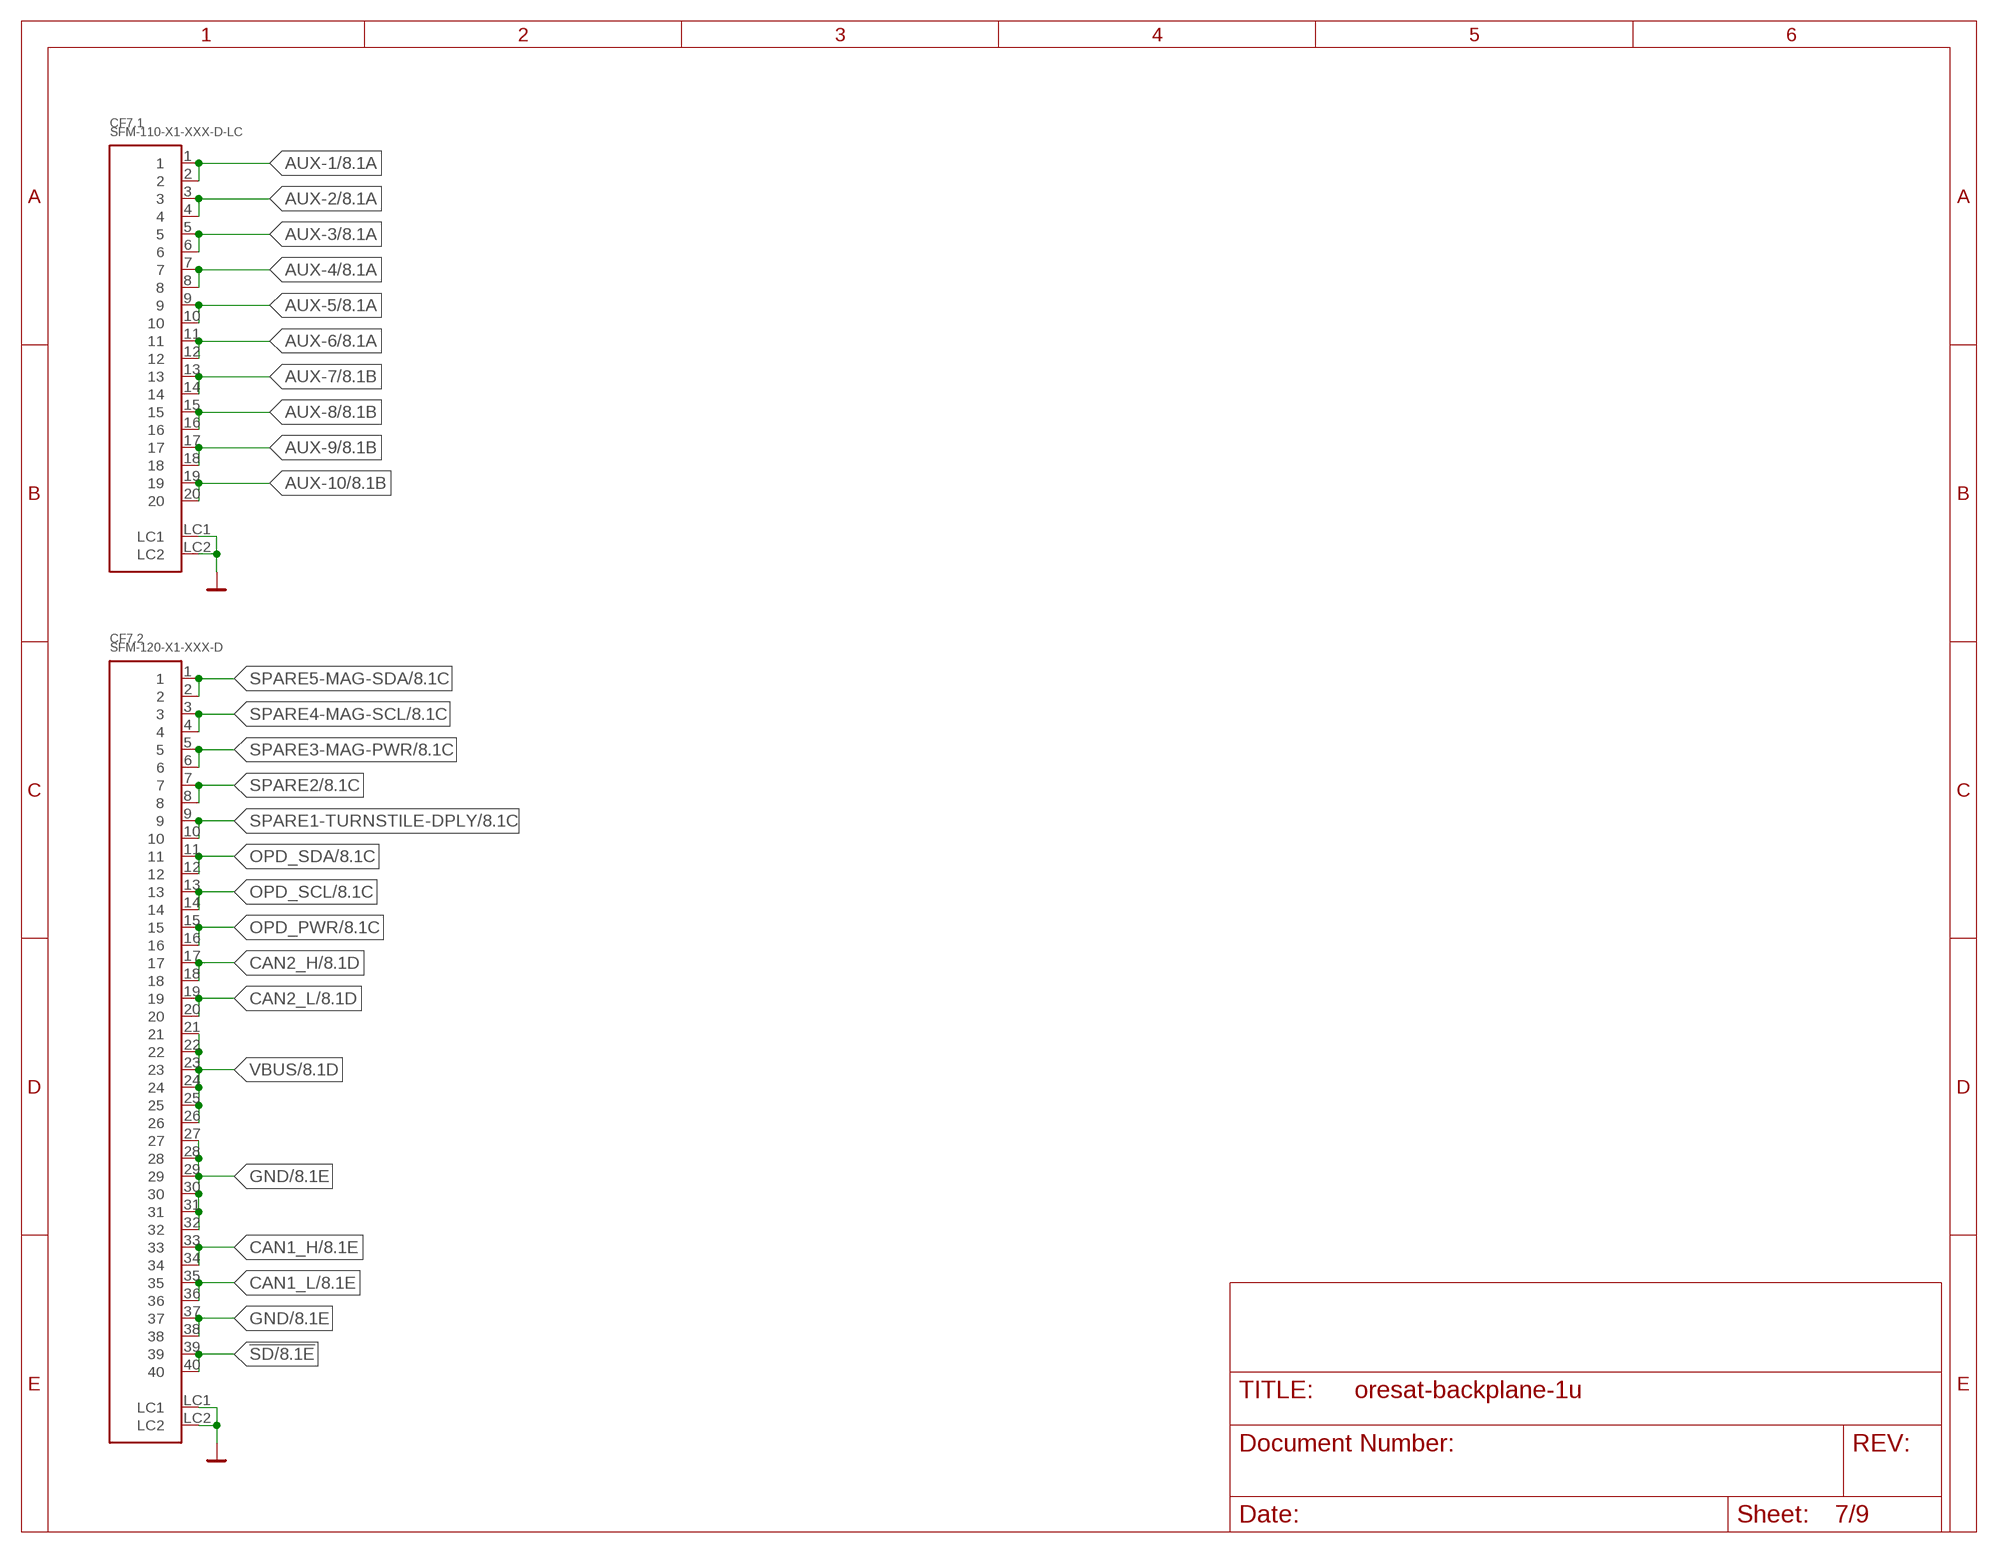
[diagram p6: schematic, sheet 7]

### Parts
CF7.1  SFM-110-X1-XXX-D-LC  [SFM-110-X1-XXX-D-LC]
CF7.2  SFM-120-X1-XXX-D  [SFM-120-X1-XXX-D]

### Nets
!SD [SHUTDOWN]: CF7.2.39 CF7.2.40 ; also sheet 1,2,3,4,5,6,8
AUX-1: CF7.1.1 CF7.1.2 ; also sheet 2,3,4,8
AUX-2: CF7.1.3 CF7.1.4 ; also sheet 2,3,4,8
AUX-3: CF7.1.5 CF7.1.6 ; also sheet 2,3,4,8
AUX-4: CF7.1.7 CF7.1.8 ; also sheet 2,3,4,8
AUX-5: CF7.1.9 CF7.1.10 ; also sheet 2,3,4,8
AUX-6: CF7.1.11 CF7.1.12 ; also sheet 2,3,4,8
AUX-7: CF7.1.13 CF7.1.14 ; also sheet 2,3,4,8
AUX-8: CF7.1.15 CF7.1.16 ; also sheet 2,3,4,8
AUX-9: CF7.1.17 CF7.1.18 ; also sheet 2,3,4,8
AUX-10: CF7.1.19 CF7.1.20 ; also sheet 2,3,4,8
CAN1_H: CF7.2.33 CF7.2.34 ; also sheet 1,2,3,4,5,6,8
CAN1_L: CF7.2.35 CF7.2.36 ; also sheet 1,2,3,4,5,6,8
CAN2_H: CF7.2.17 CF7.2.18 ; also sheet 1,2,3,4,5,6,8
CAN2_L: CF7.2.19 CF7.2.20 ; also sheet 1,2,3,4,5,6,8
GND: CF7.1.LC1 CF7.1.LC2 CF7.2.27 CF7.2.28 CF7.2.29 CF7.2.30 CF7.2.31 CF7.2.32 CF7.2.37 CF7.2.38 CF7.2.LC1 CF7.2.LC2 ; also sheet 1,2,3,4,5,6,8,9
OPD_PWR: CF7.2.15 CF7.2.16 ; also sheet 1,2,3,4,5,6,8
OPD_SCL: CF7.2.13 CF7.2.14 ; also sheet 1,2,3,4,5,6,8
OPD_SDA: CF7.2.11 CF7.2.12 ; also sheet 1,2,3,4,5,6,8
SPARE1-TURNSTILE-DPLY: CF7.2.9 CF7.2.10 ; also sheet 1,2,3,4,5,6,8
SPARE2: CF7.2.7 CF7.2.8 ; also sheet 1,2,3,4,5,6,8,9
SPARE3-MAG-PWR: CF7.2.5 CF7.2.6 ; also sheet 1,2,3,4,5,6,8,9
SPARE4-MAG-SCL: CF7.2.3 CF7.2.4 ; also sheet 1,2,3,4,5,6,8,9
SPARE5-MAG-SDA: CF7.2.1 CF7.2.2 ; also sheet 1,2,3,4,5,6,8,9
VBUS: CF7.2.21 CF7.2.22 CF7.2.23 CF7.2.24 CF7.2.25 CF7.2.26 ; also sheet 1,2,3,4,5,6,8

## Sheet 8 of 9: Slot 8
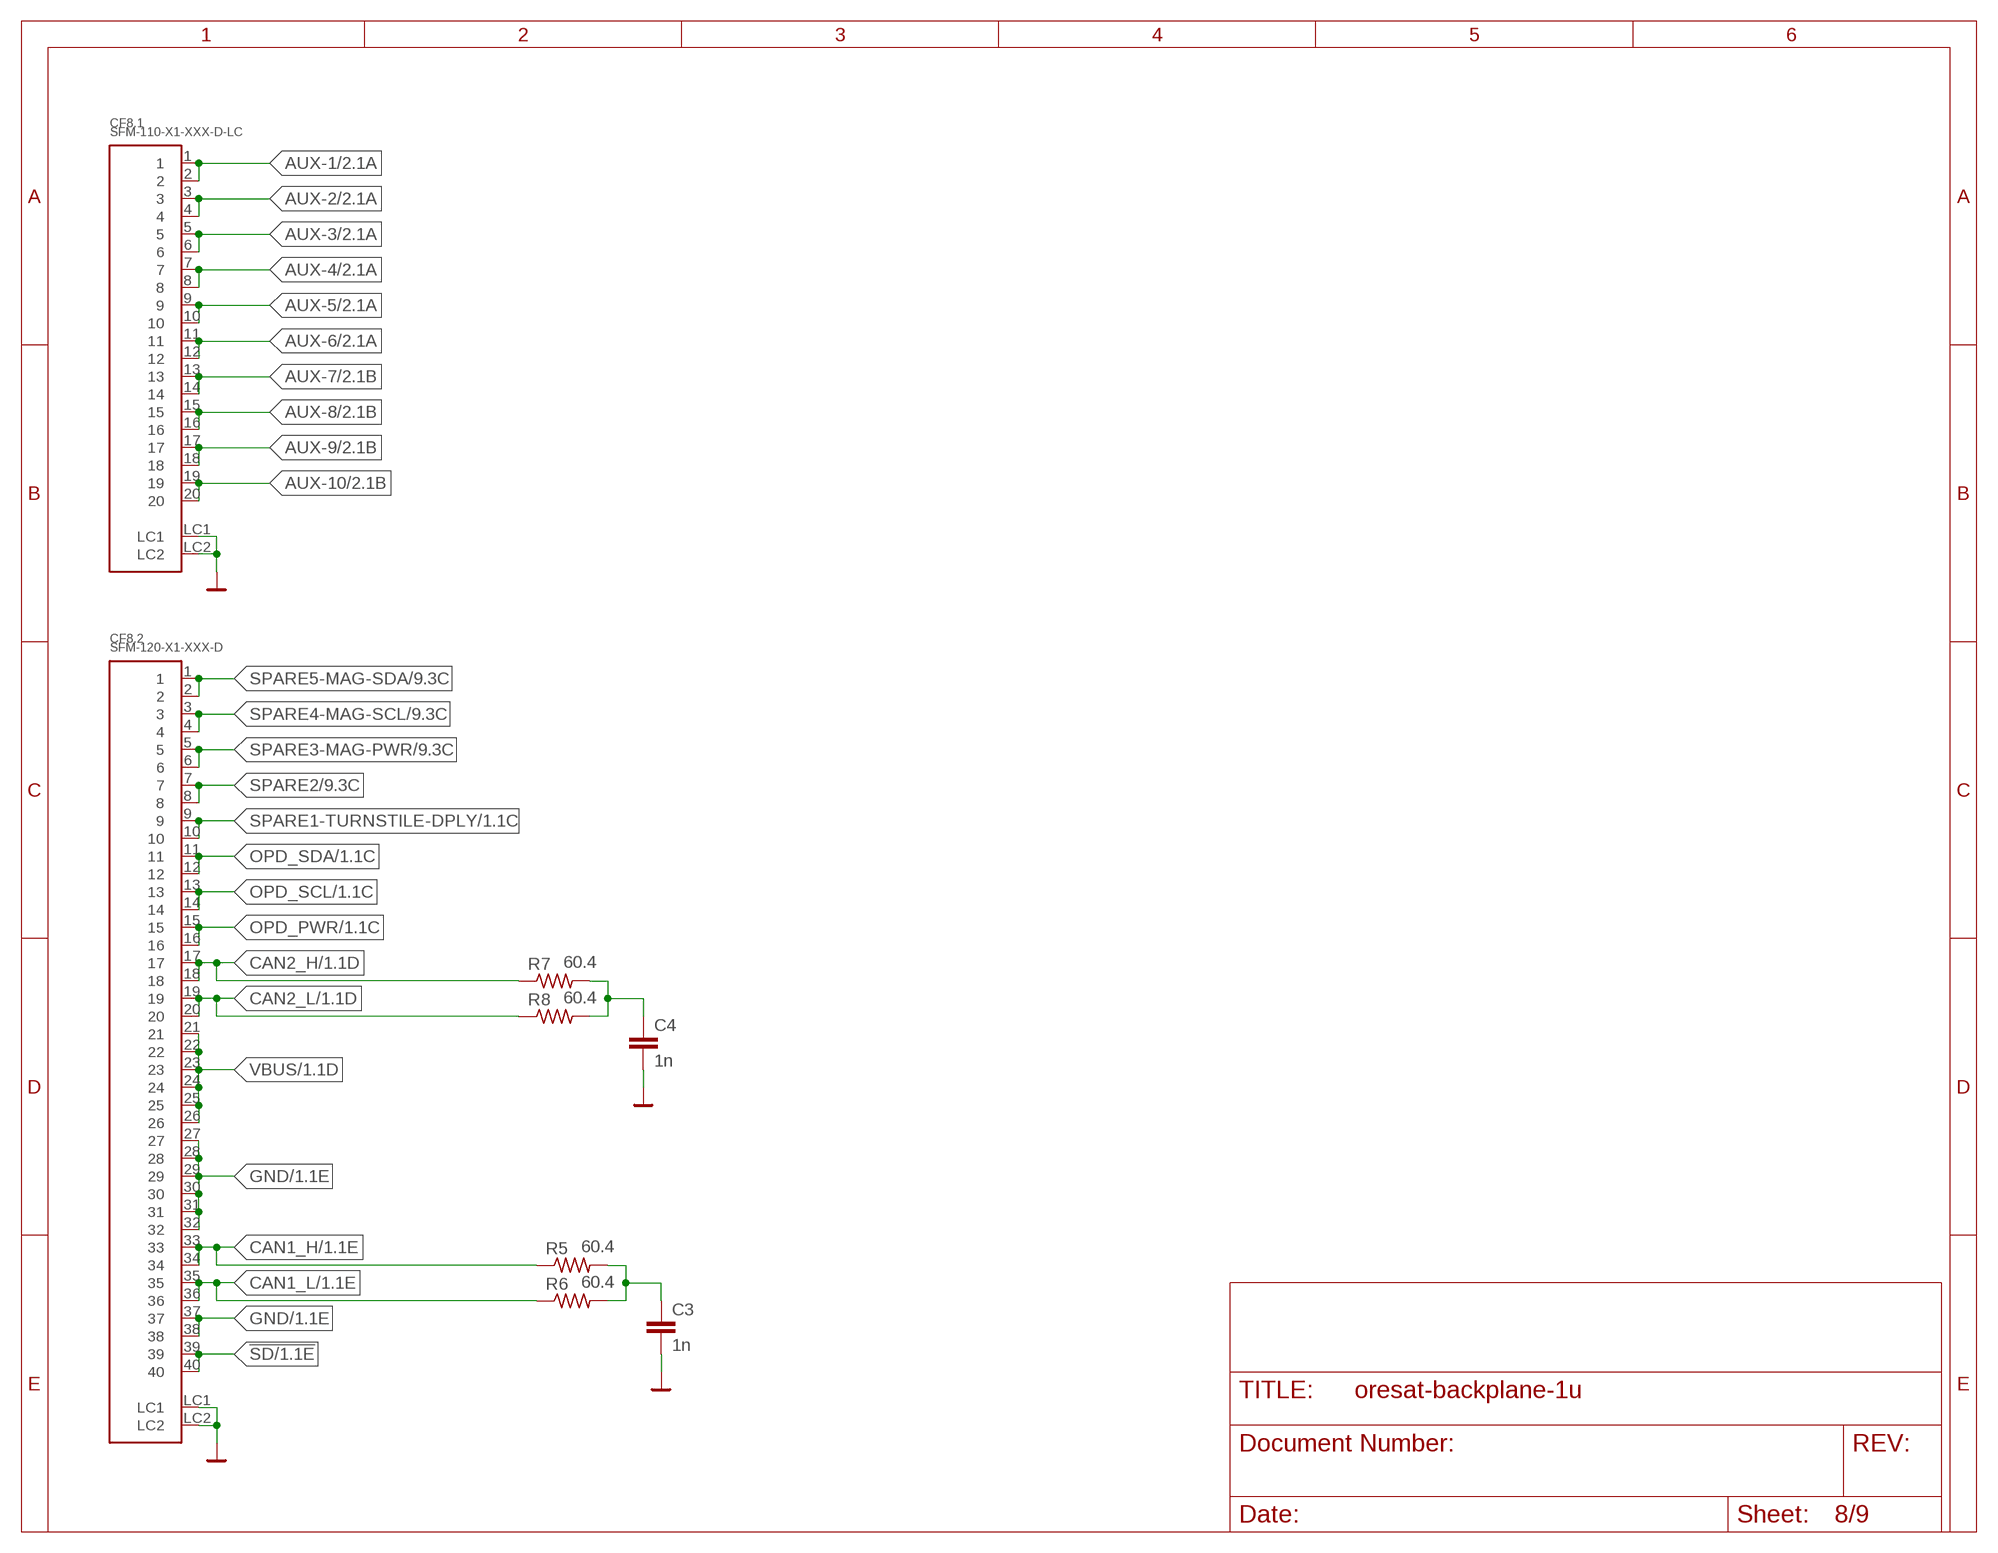
[diagram p7: schematic, sheet 8]

### Parts
C3  1n  C-EU0603-C-NOSILK  [.0603-C-NOSILK]
C4  1n  C-EU0603-C-NOSILK  [.0603-C-NOSILK]
CF8.1  SFM-110-X1-XXX-D-LC  [SFM-110-X1-XXX-D-LC]
CF8.2  SFM-120-X1-XXX-D  [SFM-120-X1-XXX-D]
R5  60.4  R-US_1206-C  [1206-C]
R6  60.4  R-US_1206-C  [1206-C]
R7  60.4  R-US_1206-C  [1206-C]
R8  60.4  R-US_1206-C  [1206-C]

### Nets
!SD [SHUTDOWN]: CF8.2.39 CF8.2.40 ; also sheet 1,2,3,4,5,6,7
AUX-1: CF8.1.1 CF8.1.2 ; also sheet 2,3,4,7
AUX-2: CF8.1.3 CF8.1.4 ; also sheet 2,3,4,7
AUX-3: CF8.1.5 CF8.1.6 ; also sheet 2,3,4,7
AUX-4: CF8.1.7 CF8.1.8 ; also sheet 2,3,4,7
AUX-5: CF8.1.9 CF8.1.10 ; also sheet 2,3,4,7
AUX-6: CF8.1.11 CF8.1.12 ; also sheet 2,3,4,7
AUX-7: CF8.1.13 CF8.1.14 ; also sheet 2,3,4,7
AUX-8: CF8.1.15 CF8.1.16 ; also sheet 2,3,4,7
AUX-9: CF8.1.17 CF8.1.18 ; also sheet 2,3,4,7
AUX-10: CF8.1.19 CF8.1.20 ; also sheet 2,3,4,7
CAN1_H: CF8.2.33 CF8.2.34 R5.1 ; also sheet 1,2,3,4,5,6,7
CAN1_L: CF8.2.35 CF8.2.36 R6.1 ; also sheet 1,2,3,4,5,6,7
CAN2_H: CF8.2.17 CF8.2.18 R7.1 ; also sheet 1,2,3,4,5,6,7
CAN2_L: CF8.2.19 CF8.2.20 R8.1 ; also sheet 1,2,3,4,5,6,7
GND: C3.2 C4.2 CF8.1.LC1 CF8.1.LC2 CF8.2.27 CF8.2.28 CF8.2.29 CF8.2.30 CF8.2.31 CF8.2.32 CF8.2.37 CF8.2.38 CF8.2.LC1 CF8.2.LC2 ; also sheet 1,2,3,4,5,6,7,9
N$3: C4.1 R7.2 R8.2
N$4: C3.1 R5.2 R6.2
OPD_PWR: CF8.2.15 CF8.2.16 ; also sheet 1,2,3,4,5,6,7
OPD_SCL: CF8.2.13 CF8.2.14 ; also sheet 1,2,3,4,5,6,7
OPD_SDA: CF8.2.11 CF8.2.12 ; also sheet 1,2,3,4,5,6,7
SPARE1-TURNSTILE-DPLY: CF8.2.9 CF8.2.10 ; also sheet 1,2,3,4,5,6,7
SPARE2: CF8.2.7 CF8.2.8 ; also sheet 1,2,3,4,5,6,7,9
SPARE3-MAG-PWR: CF8.2.5 CF8.2.6 ; also sheet 1,2,3,4,5,6,7,9
SPARE4-MAG-SCL: CF8.2.3 CF8.2.4 ; also sheet 1,2,3,4,5,6,7,9
SPARE5-MAG-SDA: CF8.2.1 CF8.2.2 ; also sheet 1,2,3,4,5,6,7,9
VBUS: CF8.2.21 CF8.2.22 CF8.2.23 CF8.2.24 CF8.2.25 CF8.2.26 ; also sheet 1,2,3,4,5,6,7

## Sheet 9 of 9: To -Z End Cap
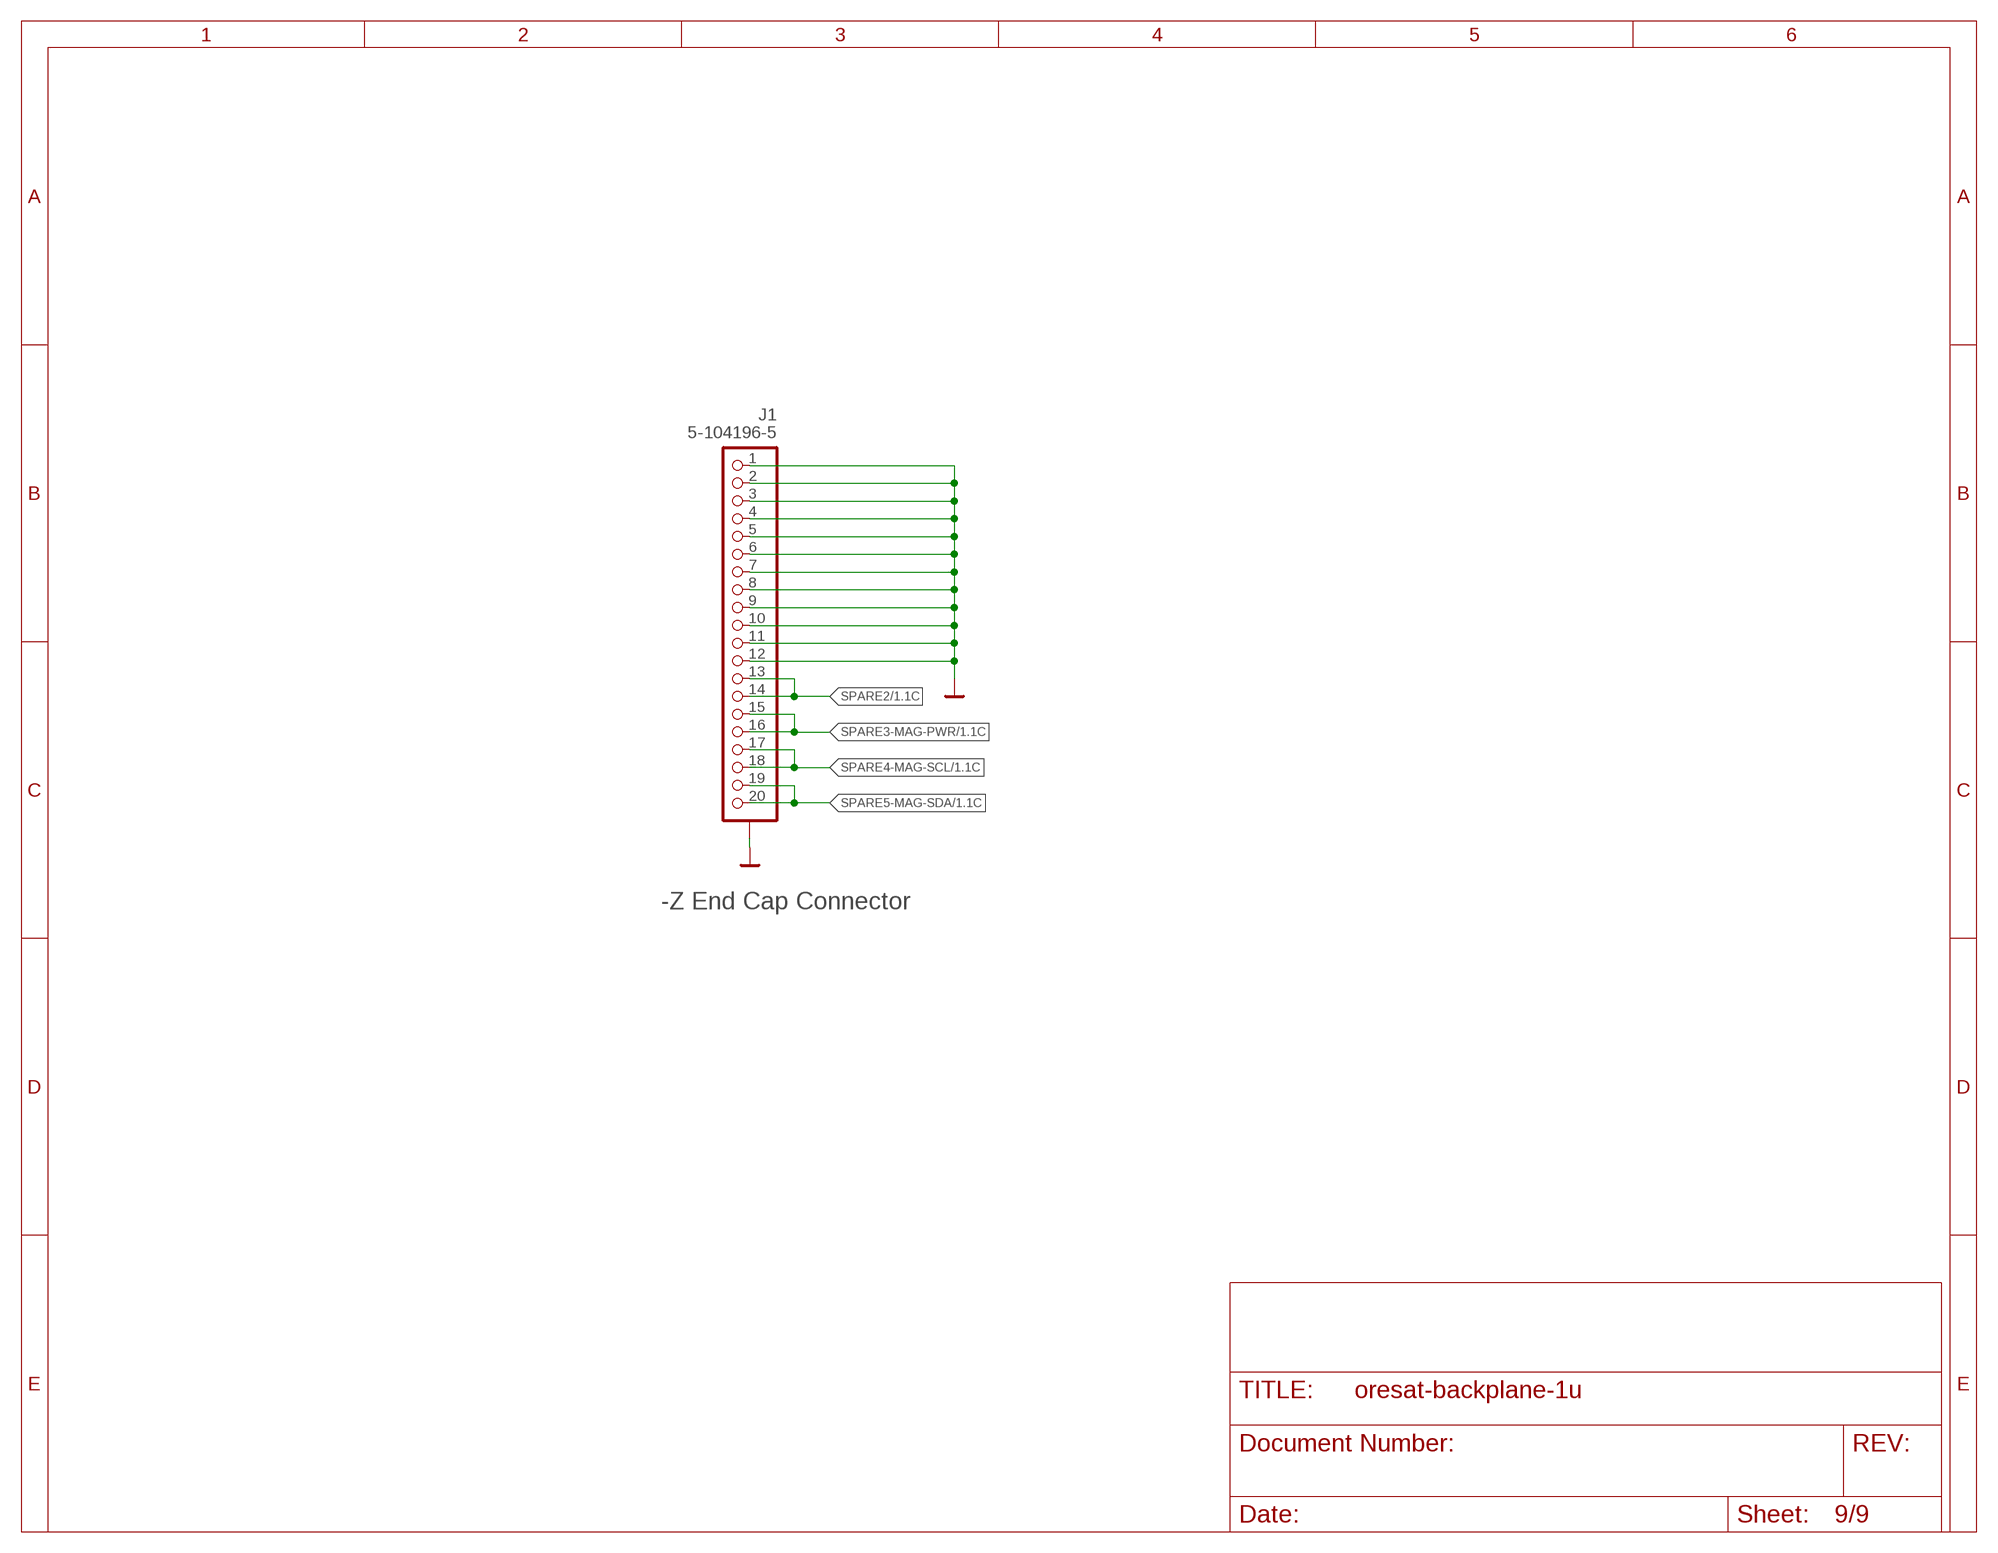
[diagram p8: schematic, sheet 9]

### Parts
J1  5-104196-5  [5-104196-5]

### Nets
GND: J1.1 J1.2 J1.3 J1.4 J1.5 J1.6 J1.7 J1.8 J1.9 J1.10 J1.11 J1.12 J1.HD1(HD) J1.HD2(HD) J1.HD3(HD) ; also sheet 1,2,3,4,5,6,7,8
SPARE2: J1.13 J1.14 ; also sheet 1,2,3,4,5,6,7,8
SPARE3-MAG-PWR: J1.15 J1.16 ; also sheet 1,2,3,4,5,6,7,8
SPARE4-MAG-SCL: J1.17 J1.18 ; also sheet 1,2,3,4,5,6,7,8
SPARE5-MAG-SDA: J1.19 J1.20 ; also sheet 1,2,3,4,5,6,7,8

### Notes on the sheet
- -Z End Cap Connector

## Library data of the parts
C1-C4 = oresat-rcl:C-EU: CAPACITOR, European symbol
CF1.2 CF2.2 CF3.2 CF4.2 CF5.2 CF6.2 CF7.2 CF8.2 = J-Samtec-SFM-120-X1-XXX-D:SFM-120-X1-XXX-D: 0.05"X0.05" SOCKET STRIP DOUBLE ROW ASSEMBLY. MANUFACTURER: SAMTEC.
CF2.1 CF3.1 CF4.1 CF7.1 CF8.1 = J-Samtec-SFM-110-X1-XXX-D-LC:SFM-110-X1-XXX-D-LC: 0.05"X0.05" SOCKET STRIP DOUBLE ROW ASSEMBLY. MANUFACTURER: SAMTEC.
CM1.1-CM1.3 CM2.1-CM2.3 CM3.2 CM4.1 = J-Molex-73300-011x-SMPM-M-vertical:J-MOLEX-SMPM-73300-0111X
FIDUCIAL1-FIDUCIAL3 = dock_v2:FIDUCIAL: Fiducials for optical coordinate reference
J1 = J-TE-5-104196-5-RA-1.27mm-female-th:5-104196-5
J3 = J-Harwin-M50-3501042-20pin-M-1.27mm-vertical-th:HARWIN-M50-3501042
R1-R8 = oresat-rcl:R-US_: RESISTOR, American symbol
U$1 = oresat-flight-marker:FLIGHMARKER

## Net classes
1 RF: width 0.38 mm, clearance 1 mm
2 SHUTDOWN: clearance 0.3 mm

## Board
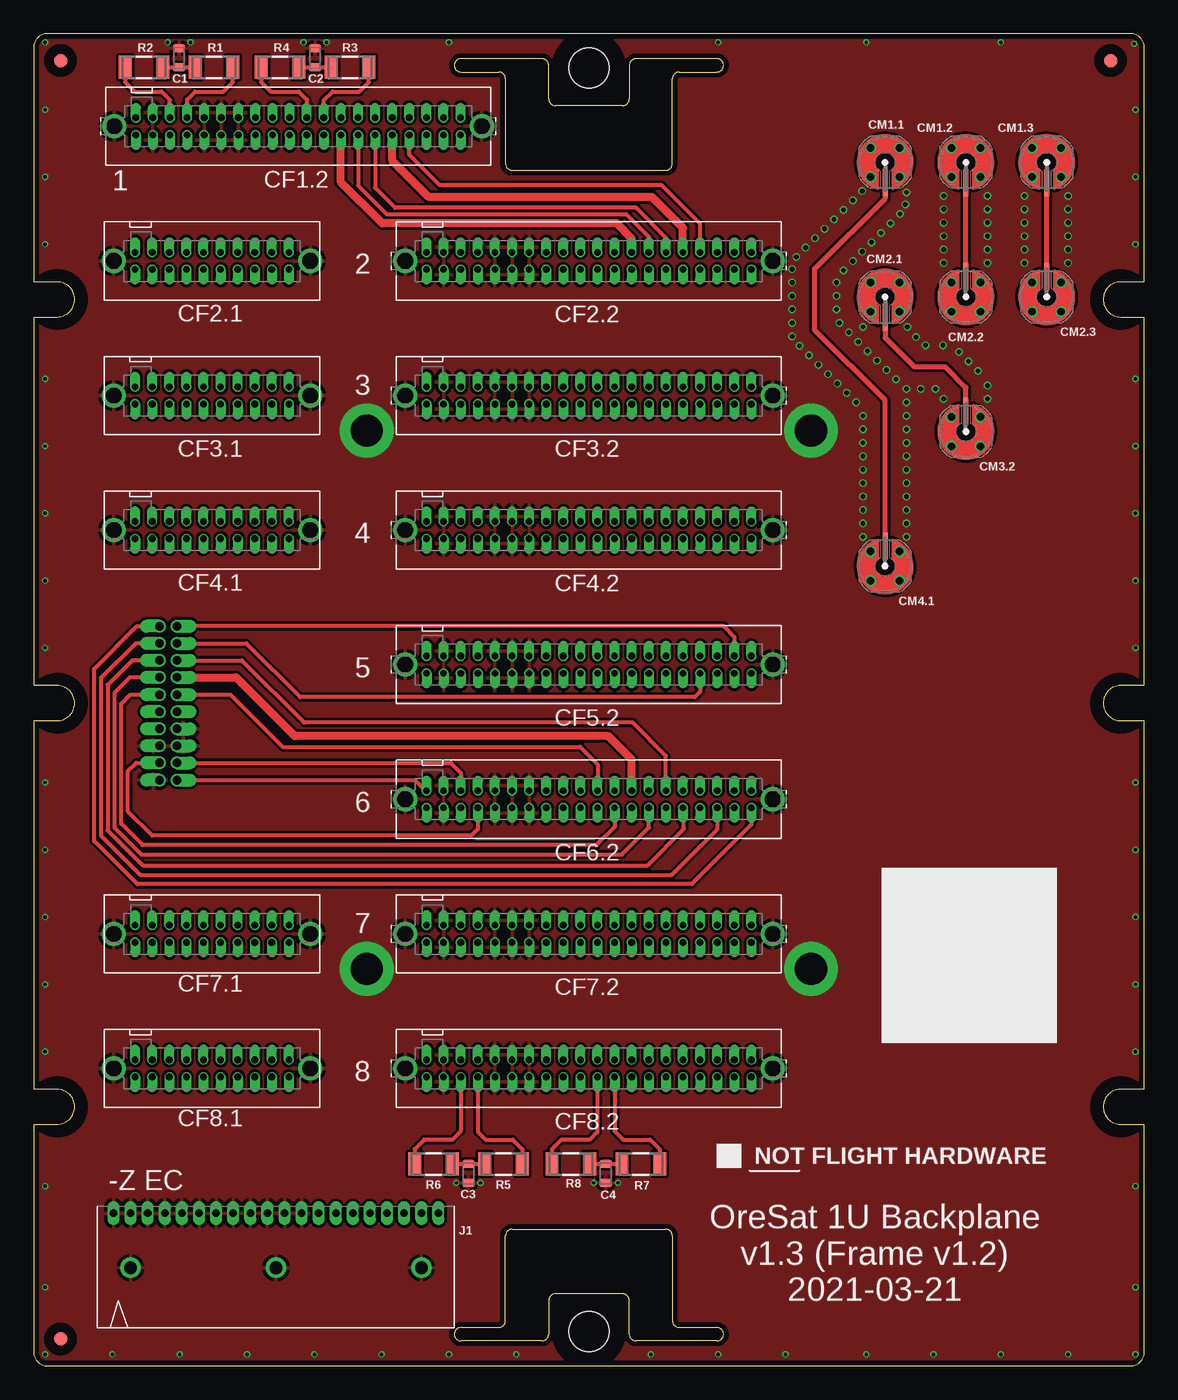
[diagram p9: board, top side]
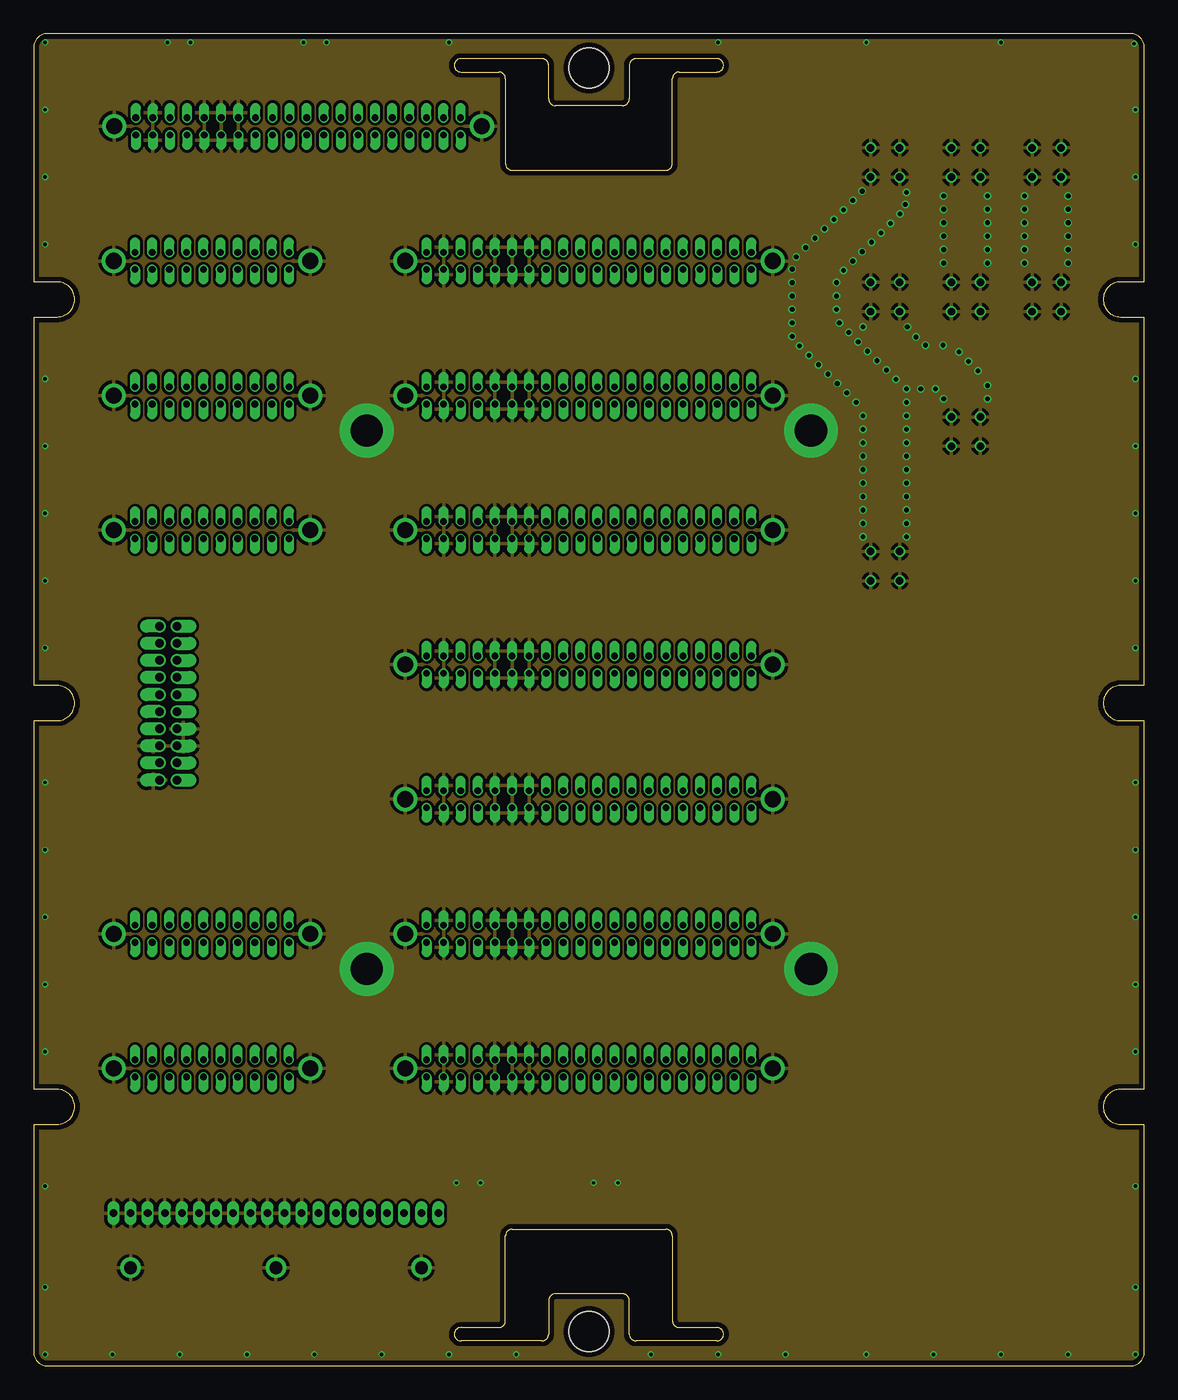
[diagram p10: board, inner layer Route2]
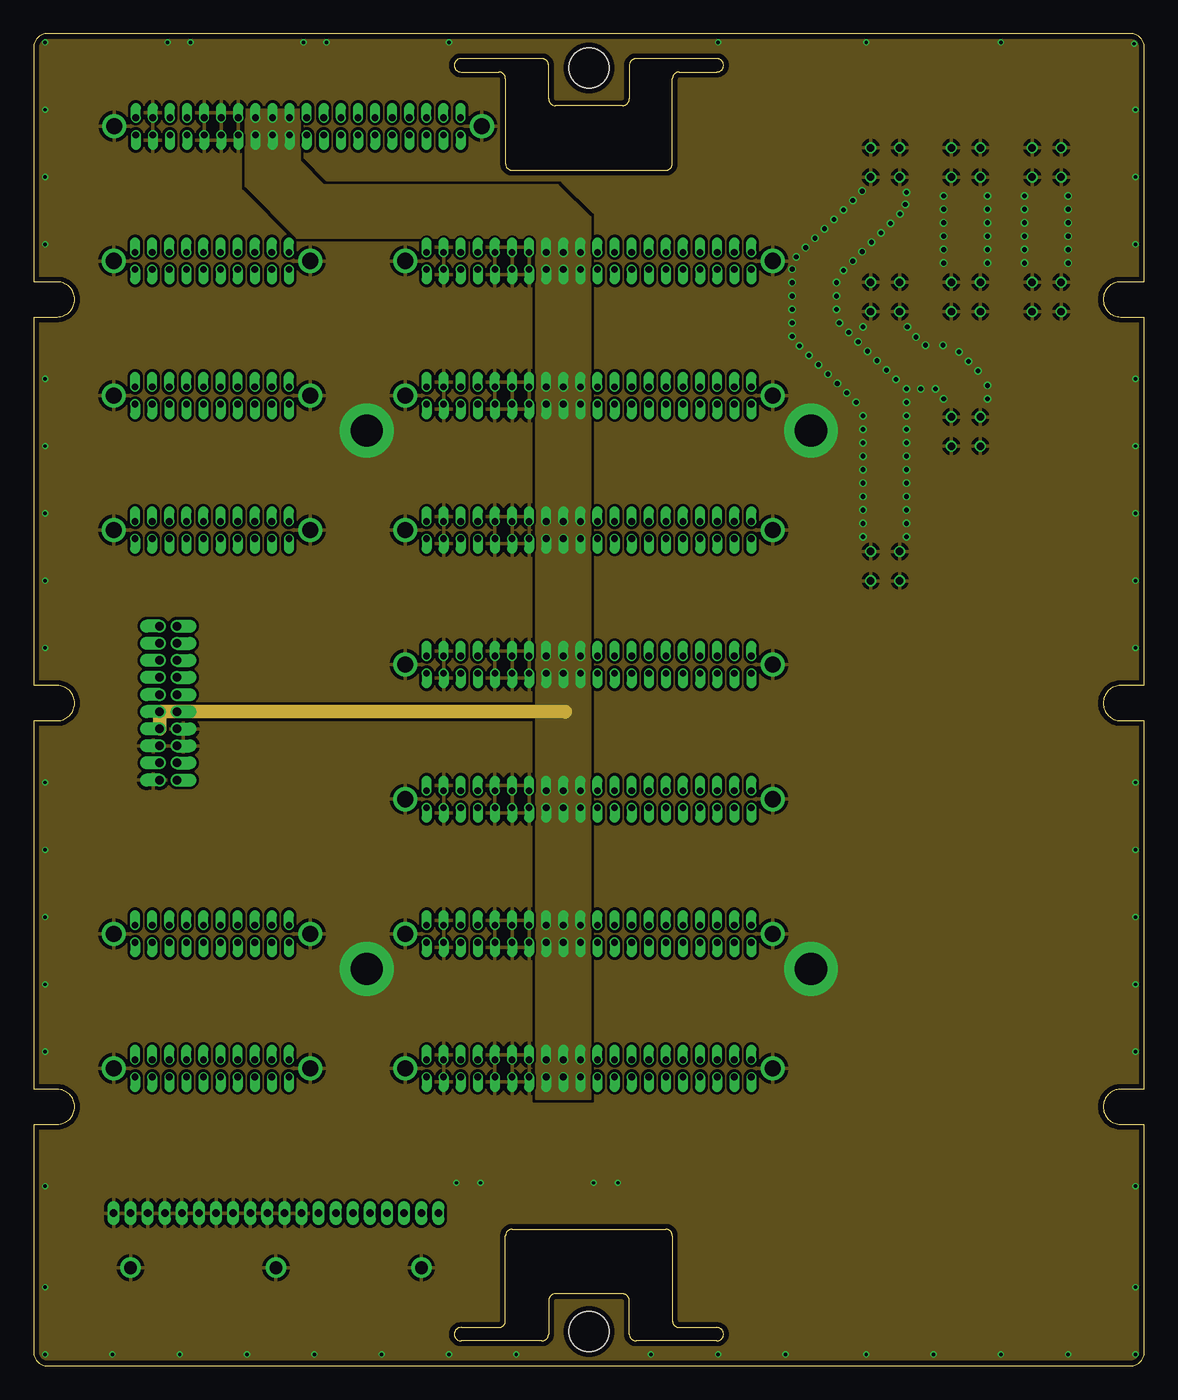
[diagram p11: board, inner layer Route15]
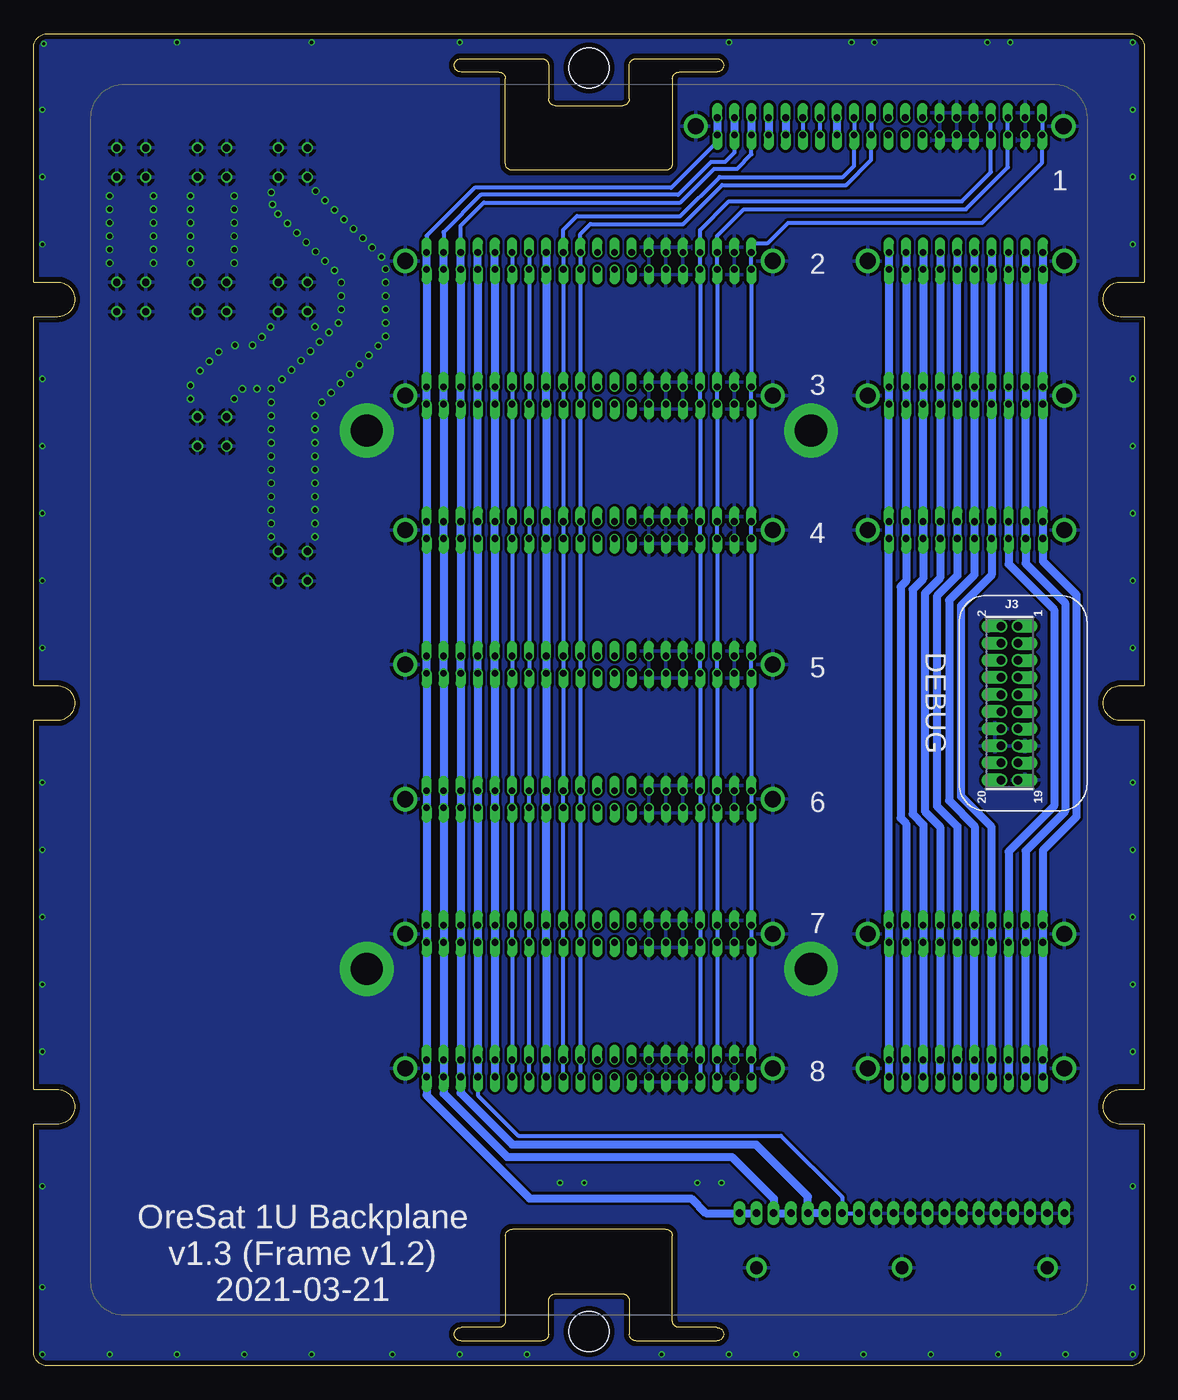
[diagram p12: board, bottom side, seen from below]

Size 82.5 x 99 mm. Coordinates in mm from the lower left corner, seen from the top.
Outline: 1,0 81.5,0 arc90 82.5,1 82.5,17.95 80.75,17.95 arc-180 80.75,20.55 82.5,20.55 82.5,47.95 80.75,47.95 arc-180 80.75,50.55 82.5,50.55 82.5,77.95 80.75,77.95 arc-180 80.75,80.55 82.5,80.55 82.5,98 arc90 81.5,99 1,99 arc90 0,98 0,80.55 1.75,80.55 arc-180 1.75,77.95 0,77.95 0,50.55 1.75,50.55 arc-180 1.75,47.95 0,47.95 0,20.55 1.75,20.55 arc-180 1.75,17.95 0,17.95 0,1 arc90 1,0
Outline: 37.75,97.15 31.75,97.15 arc180 31.75,96.15 34.55,96.15 arc-90 35.05,95.65 35.05,89.35 arc90 35.55,88.85 46.95,88.85 arc90 47.45,89.35 47.45,95.65 arc-90 47.95,96.15 50.75,96.15 arc180 50.75,97.15 44.75,97.15 arc90 44.25,96.65 44.25,94.15 arc-90 43.75,93.65 38.75,93.65 arc-90 38.25,94.15 38.25,96.65 arc90 37.75,97.15
Outline: 37.75,1.85 31.75,1.85 arc-180 31.75,2.85 34.55,2.85 arc90 35.05,3.35 35.05,9.65 arc-90 35.55,10.15 46.95,10.15 arc-90 47.45,9.65 47.45,3.35 arc90 47.95,2.85 50.75,2.85 arc-180 50.75,1.85 44.75,1.85 arc-90 44.25,2.35 44.25,4.85 arc90 43.75,5.35 38.75,5.35 arc90 38.25,4.85 38.25,2.35 arc-90 37.75,1.85
Copper layers (1*2*15*16): Top 0.035559375mm / dielectric 0.17018125mm / Route2 0.01778125mm / dielectric 47mil / Route15 0.01778125mm / dielectric 0.17018125mm / Bottom 0.035559375mm
Design rules "oshpark-4layer-tented": minimum track width 5mil, minimum drill 10mil, track to track 5mil, track to pad 5mil, pad to pad 5mil, via to via 5mil, smd to smd 5mil, copper to edge 15mil, drill to drill 6mil, minimum pad ring 4mil, minimum via ring 4mil, stop-mask expansion 2.5mil, vias tented up to drill 20mil, thermal gap 10mil
Holes 3 mm at 41.25,2.55 41.25,96.45
tRestrict: area 78.8,17.2 to 82.8,21.2; area 78.8,47.2 to 82.8,51.2; area 78.8,77.2 to 82.8,81.2; area -0.2,17.2 to 3.8,21.2; area -0.2,47.2 to 3.8,51.2; area -0.2,77.2 to 3.8,81.2; area 38.8,0 to 43.8,5; area 38.8,94 to 43.8,99

### Footprints (pad centres in the part's own frame; a part is rotated, then mirrored left to right if it is on the bottom)
.0603-C-NOSILK = smd 0.6 x 0.9: 1 -0.7,0; 2 0.7,0
SFM-120-X1-XXX-D = drill 0.5 offset: 1 12.065,-0.635; 2 12.065,0.635; 3 10.795,-0.635; 4 10.795,0.635; 5 9.525,-0.635; 6 9.525,0.635; 7 8.255,-0.635; 8 8.255,0.635; 9 6.985,-0.635; 10 6.985,0.635; 11 5.715,-0.635; 12 5.715,0.635; 13 4.445,-0.635; 14 4.445,0.635; 15 3.175,-0.635; 16 3.175,0.635; 17 1.905,-0.635; 18 1.905,0.635; 19 0.635,-0.635; 20 0.635,0.635; 21 -0.635,-0.635; 22 -0.635,0.635; 23 -1.905,-0.635; 24 -1.905,0.635; 25 -3.175,-0.635; 26 -3.175,0.635; 27 -4.445,-0.635; 28 -4.445,0.635; 29 -5.715,-0.635; 30 -5.715,0.635; 31 -6.985,-0.635; 32 -6.985,0.635; 33 -8.255,-0.635; 34 -8.255,0.635; 35 -9.525,-0.635; 36 -9.525,0.635; 37 -10.795,-0.635; 38 -10.795,0.635; 39 -12.065,-0.635; 40 -12.065,0.635 | drill 1.194: LC1 13.652,0; LC2 -13.652,0
SFM-110-X1-XXX-D-LC = drill 0.5 offset: 1 5.715,-0.635; 2 5.715,0.635; 3 4.445,-0.635; 4 4.445,0.635; 5 3.175,-0.635; 6 3.175,0.635; 7 1.905,-0.635; 8 1.905,0.635; 9 0.635,-0.635; 10 0.635,0.635; 11 -0.635,-0.635; 12 -0.635,0.635; 13 -1.905,-0.635; 14 -1.905,0.635; 15 -3.175,-0.635; 16 -3.175,0.635; 17 -4.445,-0.635; 18 -4.445,0.635; 19 -5.715,-0.635; 20 -5.715,0.635 | drill 1.194: LC1 7.303,0; LC2 -7.303,0
J-MOLEX-SMPM-73300-0111X = drill 0.55: P$1 -1.08,-1.09; P$2 1.08,-1.09; P$3 1.08,1.09; P$4 -1.08,1.09 | smd 0.38 x 2: RF-DOWN 0,1.5
FIDUCIAL-1.0X2.0 = smd 1 x 1: FIDUCIAL 0,0
5-104196-5 = drill 0.56 pad 0.9 long: 1 -12.065,0; 2 -10.795,0; 3 -9.525,0; 4 -8.255,0; 5 -6.985,0; 6 -5.715,0; 7 -4.445,0; 8 -3.175,0; 9 -1.905,0; 10 -0.635,0; 11 0.635,0; 12 1.905,0; 13 3.175,0; 14 4.445,0; 15 5.715,0; 16 6.985,0; 17 8.255,0; 18 9.525,0; 19 10.795,0; 20 12.065,0 | drill 0.94 pad 1.52: HD1 -10.8,-4.06; HD2 0,-4.06; HD3 10.8,-4.06
HARWIN-M50-3501042 = drill 0.635 pad 0.965 offset: 1 -5.715,0.635; 2 -5.715,-0.635; 3 -4.445,0.635; 4 -4.445,-0.635; 5 -3.175,0.635; 6 -3.175,-0.635; 7 -1.905,0.635; 8 -1.905,-0.635; 9 -0.635,0.635; 10 -0.635,-0.635; 11 0.635,0.635; 12 0.635,-0.635; 13 1.905,0.635; 14 1.905,-0.635; 15 3.175,0.635; 16 3.175,-0.635; 17 4.445,0.635; 18 4.445,-0.635; 19 5.715,0.635; 20 5.715,-0.635
1206-C = smd 0.95 x 1.7: 1 -1.4,0; 2 1.4,0

### Placement (x,y rotation side)
C1  10.8,97.2 90 top
C2  20.9,97.2 90 top
C3  32.3,14.3 270 top
C4  42.5,14.3 270 top
CF1.2  19.65,92.11 0 top
CF2.1  13.25,82.11 0 top
CF2.2  41.25,82.11 0 top
CF3.1  13.25,72.11 0 top
CF3.2  41.25,72.11 0 top
CF4.1  13.25,62.11 0 top
CF4.2  41.25,62.11 0 top
CF5.2  41.25,52.11 0 top
CF6.2  41.25,42.11 0 top
CF7.1  13.25,32.11 0 top
CF7.2  41.25,32.11 0 top
CF8.1  13.25,22.11 0 top
CF8.2  41.25,22.11 0 top
CM1.1  63.25,89.43 180 top
CM1.2  69.25,89.43 180 top
CM1.3  75.25,89.43 180 top
CM2.1  63.25,79.43 180 top
CM2.2  69.25,79.43 0 top
CM2.3  75.25,79.43 0 top
CM3.2  69.25,69.43 0 top
CM4.1  63.25,59.43 0 top
FIDUCIAL1  80,97 0 top
FIDUCIAL2  2,97 0 top
FIDUCIAL3  2,2 0 top
J1  18,11.35 0 top
J3  10,49.25 270 bottom
R1  13.4,96.5 180 top
R2  8.2,96.5 0 top
R3  23.5,96.5 180 top
R4  18.3,96.5 0 top
R5  34.9,15 180 top
R6  29.7,15 0 top
R7  45.1,15 180 top
R8  39.9,15 0 top
U$1  51,15 0 top

### Tracks (layer width: path | path; a pad name or v marks a point on that pad's centre or on a via)
!SD
  Top 0.3: J3.20 28.3,43.53 29.09,42.74 CF6.2.40
  Bottom 0.3: CF8.2.39 CF8.2.40 CF7.2.39 CF7.2.40 CF6.2.39 CF6.2.40 CF5.2.39 CF5.2.40 CF4.2.39 CF4.2.40 CF3.2.39 CF3.2.40 CF2.2.39 CF2.2.40 29.18,83.44 27.95,83.44 26.45,84.95 12.05,84.95 7.58,89.42 CF1.2.39 CF1.2.40
AUX-1
  Bottom 0.6: CF8.1.1 CF8.1.2 CF7.1.1 CF7.1.2 CF4.1.1 CF4.1.2 CF3.1.1 CF3.1.2 CF2.1.1 CF2.1.2
AUX-2
  Bottom 0.6: CF4.1.4 CF4.1.3 | CF4.1.3 CF3.1.3 CF3.1.4 CF2.1.3 CF2.1.4 | CF8.1.3 CF8.1.4 CF7.1.3 CF7.1.4 17.7,40.3 18.1,40.7 18.1,57.9 17.7,58.3 CF4.1.3
AUX-3
  Bottom 0.6: CF4.1.6 CF4.1.5 | CF8.1.6 CF8.1.5 CF7.1.5 CF7.1.6 16.4,32.77 16.4,40.2 17.2,41 17.2,57.7 16.43,58.48 CF4.1.5 | CF4.1.5 CF3.1.5 CF3.1.6 CF2.1.5 CF2.1.6
AUX-4
  Bottom 0.6: CF4.1.8 CF4.1.7 | CF4.1.7 CF3.1.7 CF3.1.8 CF2.1.7 CF2.1.8 | CF8.1.7 CF8.1.8 CF7.1.7 CF7.1.8 15.15,40.05 16.3,41.2 16.3,57.4 15.15,58.55 CF4.1.7
AUX-5
  Bottom 0.6: CF4.1.10 CF4.1.9 | CF4.1.9 CF3.1.9 CF3.1.10 CF2.1.9 CF2.1.10 | CF8.1.9 CF8.1.10 CF7.1.9 CF7.1.10 13.88,40.09 15.4,41.6 15.4,57.2 13.88,58.72 CF4.1.9
AUX-6
  Bottom 0.6: CF4.1.12 CF4.1.11 | CF8.1.12 CF8.1.11 CF7.1.11 CF7.1.12 12.6,32.76 12.6,40.1 14.5,42 14.5,56.9 12.62,58.78 CF4.1.11 | CF4.1.11 CF3.1.11 CF3.1.12 CF2.1.11 CF2.1.12
AUX-7
  Bottom 0.6: CF4.1.14 CF4.1.13 | CF8.1.14 CF8.1.13 CF7.1.13 CF7.1.14 11.35,40.05 13.6,42.3 13.6,56.5 11.35,58.76 CF4.1.13 | CF4.1.13 CF3.1.13 CF3.1.14 CF2.1.13 CF2.1.14
AUX-8
  Bottom 0.6: CF4.1.16 CF4.1.15 | CF8.1.16 CF8.1.15 CF7.1.15 CF7.1.16 10.07,38.23 6.7,41.6 6.7,56.2 10.07,59.58 CF4.1.15 | CF4.1.15 CF3.1.15 CF3.1.16 CF2.1.15 CF2.1.16
AUX-9
  Bottom 0.6: CF4.1.18 CF4.1.17 | CF8.1.18 CF8.1.17 CF7.1.17 CF7.1.18 8.8,38.27 5.87,41.2 5.87,56.7 8.8,59.63 CF4.1.17 | CF4.1.17 CF3.1.17 CF3.1.18 CF2.1.17 CF2.1.18
AUX-10
  Bottom 0.6: CF8.1.19 CF8.1.20 CF7.1.19 CF7.1.20 7.54,38.31 5.05,40.8 5.05,57.3 7.54,59.79 CF4.1.19 CF4.1.20 CF3.1.19 CF3.1.20 CF2.1.19 CF2.1.20
CAN1_H
  Top 0.3: CF1.2.34 11.39,94.09 12,94.7 14.1,94.7 14.8,95.4 R1.1 | R5.1 36.3,16.1 35.6,16.8 33.6,16.8 32.99,17.41 CF8.2.33 | CF6.2.33 32.99,39.9 32.5,39.4 8.8,39.4 7,41.2 7,44.2 7.61,44.8 J3.17
  Bottom 0.3: CF8.2.33 CF8.2.34 CF7.2.33 CF7.2.34 CF6.2.33 CF6.2.34 CF5.2.33 CF5.2.34 CF4.2.33 CF4.2.34 CF3.2.33 CF3.2.34 CF2.2.33 CF2.2.34 32.99,84.41 30.85,86.55 13.55,86.55 11.39,88.7 CF1.2.33 CF1.2.34
CAN1_L
  Top 0.3: CF1.2.36 10.12,94.08 9.5,94.7 7.5,94.7 6.8,95.4 R2.1 | R6.1 28.3,16.1 29,16.8 31.1,16.8 31.73,17.43 CF8.2.35 | J3.18 31,44.8 31.73,44.08 CF6.2.36
  Bottom 0.3: CF8.2.35 CF8.2.36 CF7.2.35 CF7.2.36 CF6.2.35 CF6.2.36 CF5.2.35 CF5.2.36 CF4.2.35 CF4.2.36 CF3.2.35 CF3.2.36 CF2.2.35 CF2.2.36 31.73,83.97 29.75,85.95 13.25,85.95 10.12,89.08 CF1.2.35 CF1.2.36
CAN2_H
  Top 0.3: CF1.2.18 21.55,94.06 22.2,94.7 24.2,94.7 24.9,95.4 R3.1 | R7.1 46.5,16.1 45.8,16.8 43.8,16.8 43.16,17.45 CF8.2.17 | CF6.2.17 43.16,40.05 41.8,38.7 8.1,38.7 6.5,40.3 6.5,49.2 7.18,49.88 J3.9
  Bottom 0.3: CF8.2.17 CF8.2.18 CF7.2.17 CF7.2.18 CF6.2.17 CF6.2.18 CF5.2.17 CF5.2.18 CF4.2.17 CF4.2.18 CF3.2.17 CF3.2.18 CF2.2.17 CF2.2.18 43.16,84.44 42.15,85.45 34.45,85.45 31.55,88.35 22.39,88.35 21.55,89.19 CF1.2.17 CF1.2.18
CAN2_L
  Top 0.2: 41.9,42.76 CF6.2.20
  Top 0.3: R4.1 16.9,95.4 17.6,94.7 19.7,94.7 20.3,94.1 CF1.2.20 | R8.1 38.5,16.1 39.2,16.8 41.3,16.8 41.88,17.39 CF8.2.19 | J3.10 14.62,49.88 18.5,46 40.6,46 41.9,44.7 41.9,42.76
  Bottom 0.3: CF8.2.19 CF8.2.20 CF7.2.19 CF7.2.20 CF6.2.19 CF6.2.20 CF5.2.19 CF5.2.20 CF4.2.19 CF4.2.20 CF3.2.19 CF3.2.20 CF2.2.19 CF2.2.20 41.88,84.11 41.15,84.85 34.25,84.85 31.35,87.75 22.15,87.75 20.29,89.61 CF1.2.19 CF1.2.20
GND  (via drill 0.25, 0.35 pad 0.25, 2.4 pad 4)
  other vias: 24.75,29.5 57.75,29.5 67.6,85.95 67.6,84.95 67.6,83.95 67.6,82.95 67.6,81.95 67.6,86.95 70.85,85.95 70.85,84.95 70.85,83.95 70.85,82.95 70.85,81.95 70.85,86.95 64.85,62.6 64.85,63.6 61.6,62.6 61.6,63.6 61.6,64.6 64.85,64.6 61.6,61.6 64.85,61.6 64.85,65.6 64.85,66.6 61.6,65.6 61.6,66.6 61.6,67.6 64.85,67.6 64.85,68.6 64.85,69.6 61.6,68.6 61.6,69.6 61.6,70.6 64.85,70.6 0.85,98.35 11.65,98.35 21.75,98.35 30.85,98.35 50.85,98.35 61.85,98.35 71.85,98.35 81.75,98.25 0.85,0.85 10.85,0.85 20.85,0.85 30.85,0.85 50.85,0.85 61.85,0.85 71.85,0.85 81.85,0.85 5.85,0.85 15.85,0.85 25.85,0.85 35.85,0.85 45.85,0.85 55.85,0.85 66.85,0.85 76.85,0.85 81.85,5.85 81.85,93.35 81.85,88.35 81.85,83.35 81.85,73.35 81.85,68.35 81.85,63.35 81.85,53.35 81.85,58.35 81.85,43.35 81.85,38.35 81.85,33.35 81.85,28.35 81.85,23.35 81.85,13.35 0.85,5.85 0.85,93.35 0.85,88.35 0.85,83.35 0.85,73.35 0.85,68.35 0.85,63.35 0.85,53.35 0.85,58.35 0.85,43.35 0.85,38.35 0.85,33.35 0.85,28.35 0.85,23.35 0.85,13.35 9.95,98.35 20.05,98.35 31.4,13.6 33.2,13.6 41.6,13.6 43.4,13.6 57.75,69.5 24.75,69.5 73.6,85.95 73.6,84.95 73.6,83.95 73.6,82.95 73.6,81.95 73.6,86.95 76.85,85.95 76.85,84.95 76.85,83.95 76.85,82.95 76.85,81.95 76.85,86.95 67.6,71.85 70.85,71.85 64.85,71.6 64.85,72.6 64.05,73.3 63.35,74 62.65,74.7 61.95,75.4 61.25,76.1 60.55,76.8 59.85,77.5 61.1,71.6 60.4,72.3 59.7,73 59,73.7 58.3,74.4 57.6,75.1 56.9,75.8 70.85,72.85 70.15,73.95 69.45,74.65 68.75,75.35 65.55,76.45 64.9,77.2 66.25,75.85 67.55,75.85 67,72.6 65.9,72.6 61.6,77.2 59.65,78.5 59.65,79.5 59.65,80.5 60.15,81.4 60.85,82.1 61.55,82.8 62.25,83.5 62.95,84.2 63.65,84.9 64.35,85.6 64.75,86.3 64.85,87.2 61.55,87.3 56.65,82.4 57.35,83.1 58.05,83.8 58.75,84.5 59.45,85.2 60.15,85.9 60.85,86.6 56.35,81.5 56.35,80.5 56.35,79.5 56.35,78.5 56.35,77.5 56.35,76.5
  pour Top (isolate 0.2, rank 6): 0,0 0,99 82.5,99 82.5,0
  pour Bottom (isolate 0.2, rank 6): 0,0 0,99 82.5,99 82.5,0
  pour Route2 (isolate 0.2, rank 6): 0,0 0,99 82.5,99 82.5,0
  pour Route15 (isolate 0.2, rank 6): 0,0 0,99 82.5,99 82.5,0
L-GPS
  Top 0.38: CM2.1.RF-DOWN 63.25,76.4 65.4,74.25 67.7,74.25 69.25,72.7 CM3.2.RF-DOWN
L-TURNSTILE
  Top 0.38: CM2.2.RF-DOWN CM1.2.RF-DOWN
N$1
  Top 0.3: R4.2 C2.1 R3.2
N$2
  Top 0.3: R2.2 C1.1 R1.2
N$3
  Top 0.3: R8.2 C4.1 R7.2
N$4
  Top 0.3: R6.2 C3.1 R5.2
OPD_PWR
  Top 0.6: CF2.2.16 44.42,83.78 43.3,84.9 25.9,84.9 22.82,87.97 CF1.2.15 | CF6.2.16 44.42,45.08 42.7,46.8 19.4,46.8 15.04,51.16 J3.8
  Bottom 0.6: CF2.2.16 CF2.2.15 CF3.2.16 CF3.2.15 CF4.2.16 CF4.2.15 CF5.2.16 CF5.2.15 CF6.2.16 CF6.2.15 CF7.2.16 CF7.2.15 CF8.2.16 CF8.2.15 | CF1.2.16 CF1.2.15
OPD_SCL
  Top 0.2: CF6.2.13
  Top 0.3: CF2.2.14 45.7,83.91 44.05,85.55 26.25,85.55 24.09,87.7 CF1.2.13 | J3.7 7.16,51.16 6,50 6,40 8,38 43.7,38 45.7,40 CF6.2.13
  Bottom 0.3: CF2.2.14 CF2.2.13 CF3.2.14 CF3.2.13 CF4.2.14 CF4.2.13 CF5.2.14 CF5.2.13 CF6.2.14 CF6.2.13 CF7.2.14 CF7.2.13 CF8.2.14 CF8.2.13 | CF1.2.14 CF1.2.13
OPD_SDA
  Top 0.3: CF2.2.12 46.97,83.83 44.75,86.05 26.85,86.05 25.36,87.53 CF1.2.11 | CF6.2.12 46.97,45.34 44.5,47.8 20.1,47.8 15.47,52.42 J3.6
  Bottom 0.3: CF2.2.12 CF2.2.11 CF3.2.12 CF3.2.11 CF4.2.12 CF4.2.11 CF5.2.12 CF5.2.11 CF6.2.12 CF6.2.11 CF7.2.12 CF7.2.11 CF8.2.12 CF8.2.11 | CF1.2.12 CF1.2.11
S-TURNSTILE
  Top 0.38: CM1.1.RF-DOWN 63.25,86.75 58,81.5 58,77 63.25,71.75 CM4.1.RF-DOWN
SPARE1-TURNSTILE-DPLY
  Top 0.2: 48.3,41.41 CF6.2.9
  Top 0.3: 26.65,91.46 CF1.2.9 | J3.5 7.33,52.42 5.5,50.6 5.5,39.8 8.1,37.2 45.6,37.2 48.3,39.9 48.3,41.41
  Top 0.6: CF2.2.10 48.23,84.56 45.95,86.85 29.35,86.85 26.65,89.55 26.65,91.46
  Bottom 0.6: CF2.2.10 CF2.2.9 CF3.2.10 CF3.2.9 CF4.2.10 CF4.2.9 CF5.2.10 CF5.2.9 CF6.2.10 CF6.2.9 CF7.2.10 CF7.2.9 CF8.2.10 CF8.2.9 | CF1.2.10 CF1.2.9
SPARE2
  Top 0.3: CF2.2.8 49.51,84.89 46.65,87.75 30.15,87.75 27.91,90 CF1.2.7 | J3.4 15.8,53.7 19.8,49.7 49.1,49.7 49.51,50.1 CF5.2.7
  Bottom 0.3: CF8.2.7 49.51,20.11 46.5,17.1 27,17.1 22.45,12.54 J1.14 J1.13
  Bottom 0.6: CF2.2.8 CF2.2.7 CF3.2.8 CF3.2.7 CF4.2.8 CF4.2.7 CF5.2.8 CF5.2.7 CF6.2.8 CF6.2.7 CF7.2.8 CF7.2.7 CF8.2.8 CF8.2.7 | CF1.2.8 CF1.2.7
SPARE3-MAG-PWR
  Top 0.2: 50.8,41.45 CF6.2.5
  Top 0.3: J3.3 7.59,53.7 5,51.1 5,39.4 7.9,36.5 47.4,36.5 50.8,39.9 50.8,41.45
  Bottom 0.3: CF2.2.6 50.77,84.72 49.05,86.45 34.45,86.45 31.95,88.95 30.25,88.95 29.18,90.03 CF1.2.5
  Bottom 0.6: CF2.2.6 CF2.2.5 CF3.2.6 CF3.2.5 CF4.2.6 CF4.2.5 CF5.2.6 CF5.2.5 CF6.2.6 CF6.2.5 CF7.2.6 CF7.2.5 CF8.2.6 CF8.2.5 50.77,20.27 46.96,16.46 28.84,16.46 24.98,12.6 J1.16 J1.15 | CF1.2.6 CF1.2.5
SPARE4-MAG-SCL
  Top 0.3: J3.2 51.26,54.97 52.05,54.17 CF5.2.4
  Bottom 0.3: CF1.2.3 30.45,90.16 31.15,89.45 32.2,89.45 34.63,87.02 49.28,87.02 52.05,84.25 CF2.2.4
  Bottom 0.6: CF2.2.4 CF2.2.3 CF3.2.4 CF3.2.3 CF4.2.4 CF4.2.3 CF5.2.4 CF5.2.3 CF6.2.4 CF6.2.3 CF7.2.4 CF7.2.3 CF8.2.4 CF8.2.3 52.05,20.25 47.33,15.53 30.63,15.53 27.52,12.41 J1.18 J1.17 | CF1.2.4 CF1.2.3
SPARE5-MAG-SDA
  Top 0.3: CF6.2.1 53.31,40.22 48.9,35.8 7.7,35.8 4.5,39 4.5,51.8 7.67,54.97 J3.1
  Bottom 0.3: CF1.2.1 31.75,91.44 31.75,90.95 35.15,87.55 49.75,87.55 53.31,83.98 CF2.2.2
  Bottom 0.6: CF2.2.2 CF2.2.1 CF3.2.2 CF3.2.1 CF4.2.2 CF4.2.1 CF5.2.2 CF5.2.1 CF6.2.2 CF6.2.1 CF7.2.2 CF7.2.1 CF8.2.2 CF8.2.1 53.31,20.11 45.65,12.45 33.66,12.45 32.56,11.35 J1.20 J1.19 | CF1.2.2 CF1.2.1
UHF-TURNSTILE
  Top 0.38: CM2.3.RF-DOWN CM1.3.RF-DOWN
VBUS
  Route15 1: J3.13 J3.11 J3.12 39.48,48.62 39.5,48.6
  pour Route15 (rank 2, no thermals): 37.35,19.85 37.35,83.25 36.75,83.85 19.55,83.85 15.75,87.65 15.75,93.35 19.75,93.35 19.75,89.55 21.55,87.75 38.95,87.75 41.35,85.35 41.35,19.85

### Text on the board
tPlace: 1 | 2 | 3 | 4 | 5 | 6 | 7 | 8 | -Z EC | OreSat 1U Backplane / v1.3 (Frame v1.2) / 2021-03-21
bPlace: 1 | 2 | 3 | 4 | DEBUG | 5 | 6 | 7 | 8 | OreSat 1U Backplane / v1.3 (Frame v1.2) / 2021-03-21